# Altium project Daughter_Board_IF_RX.PrjPcb (part 1 of 2)
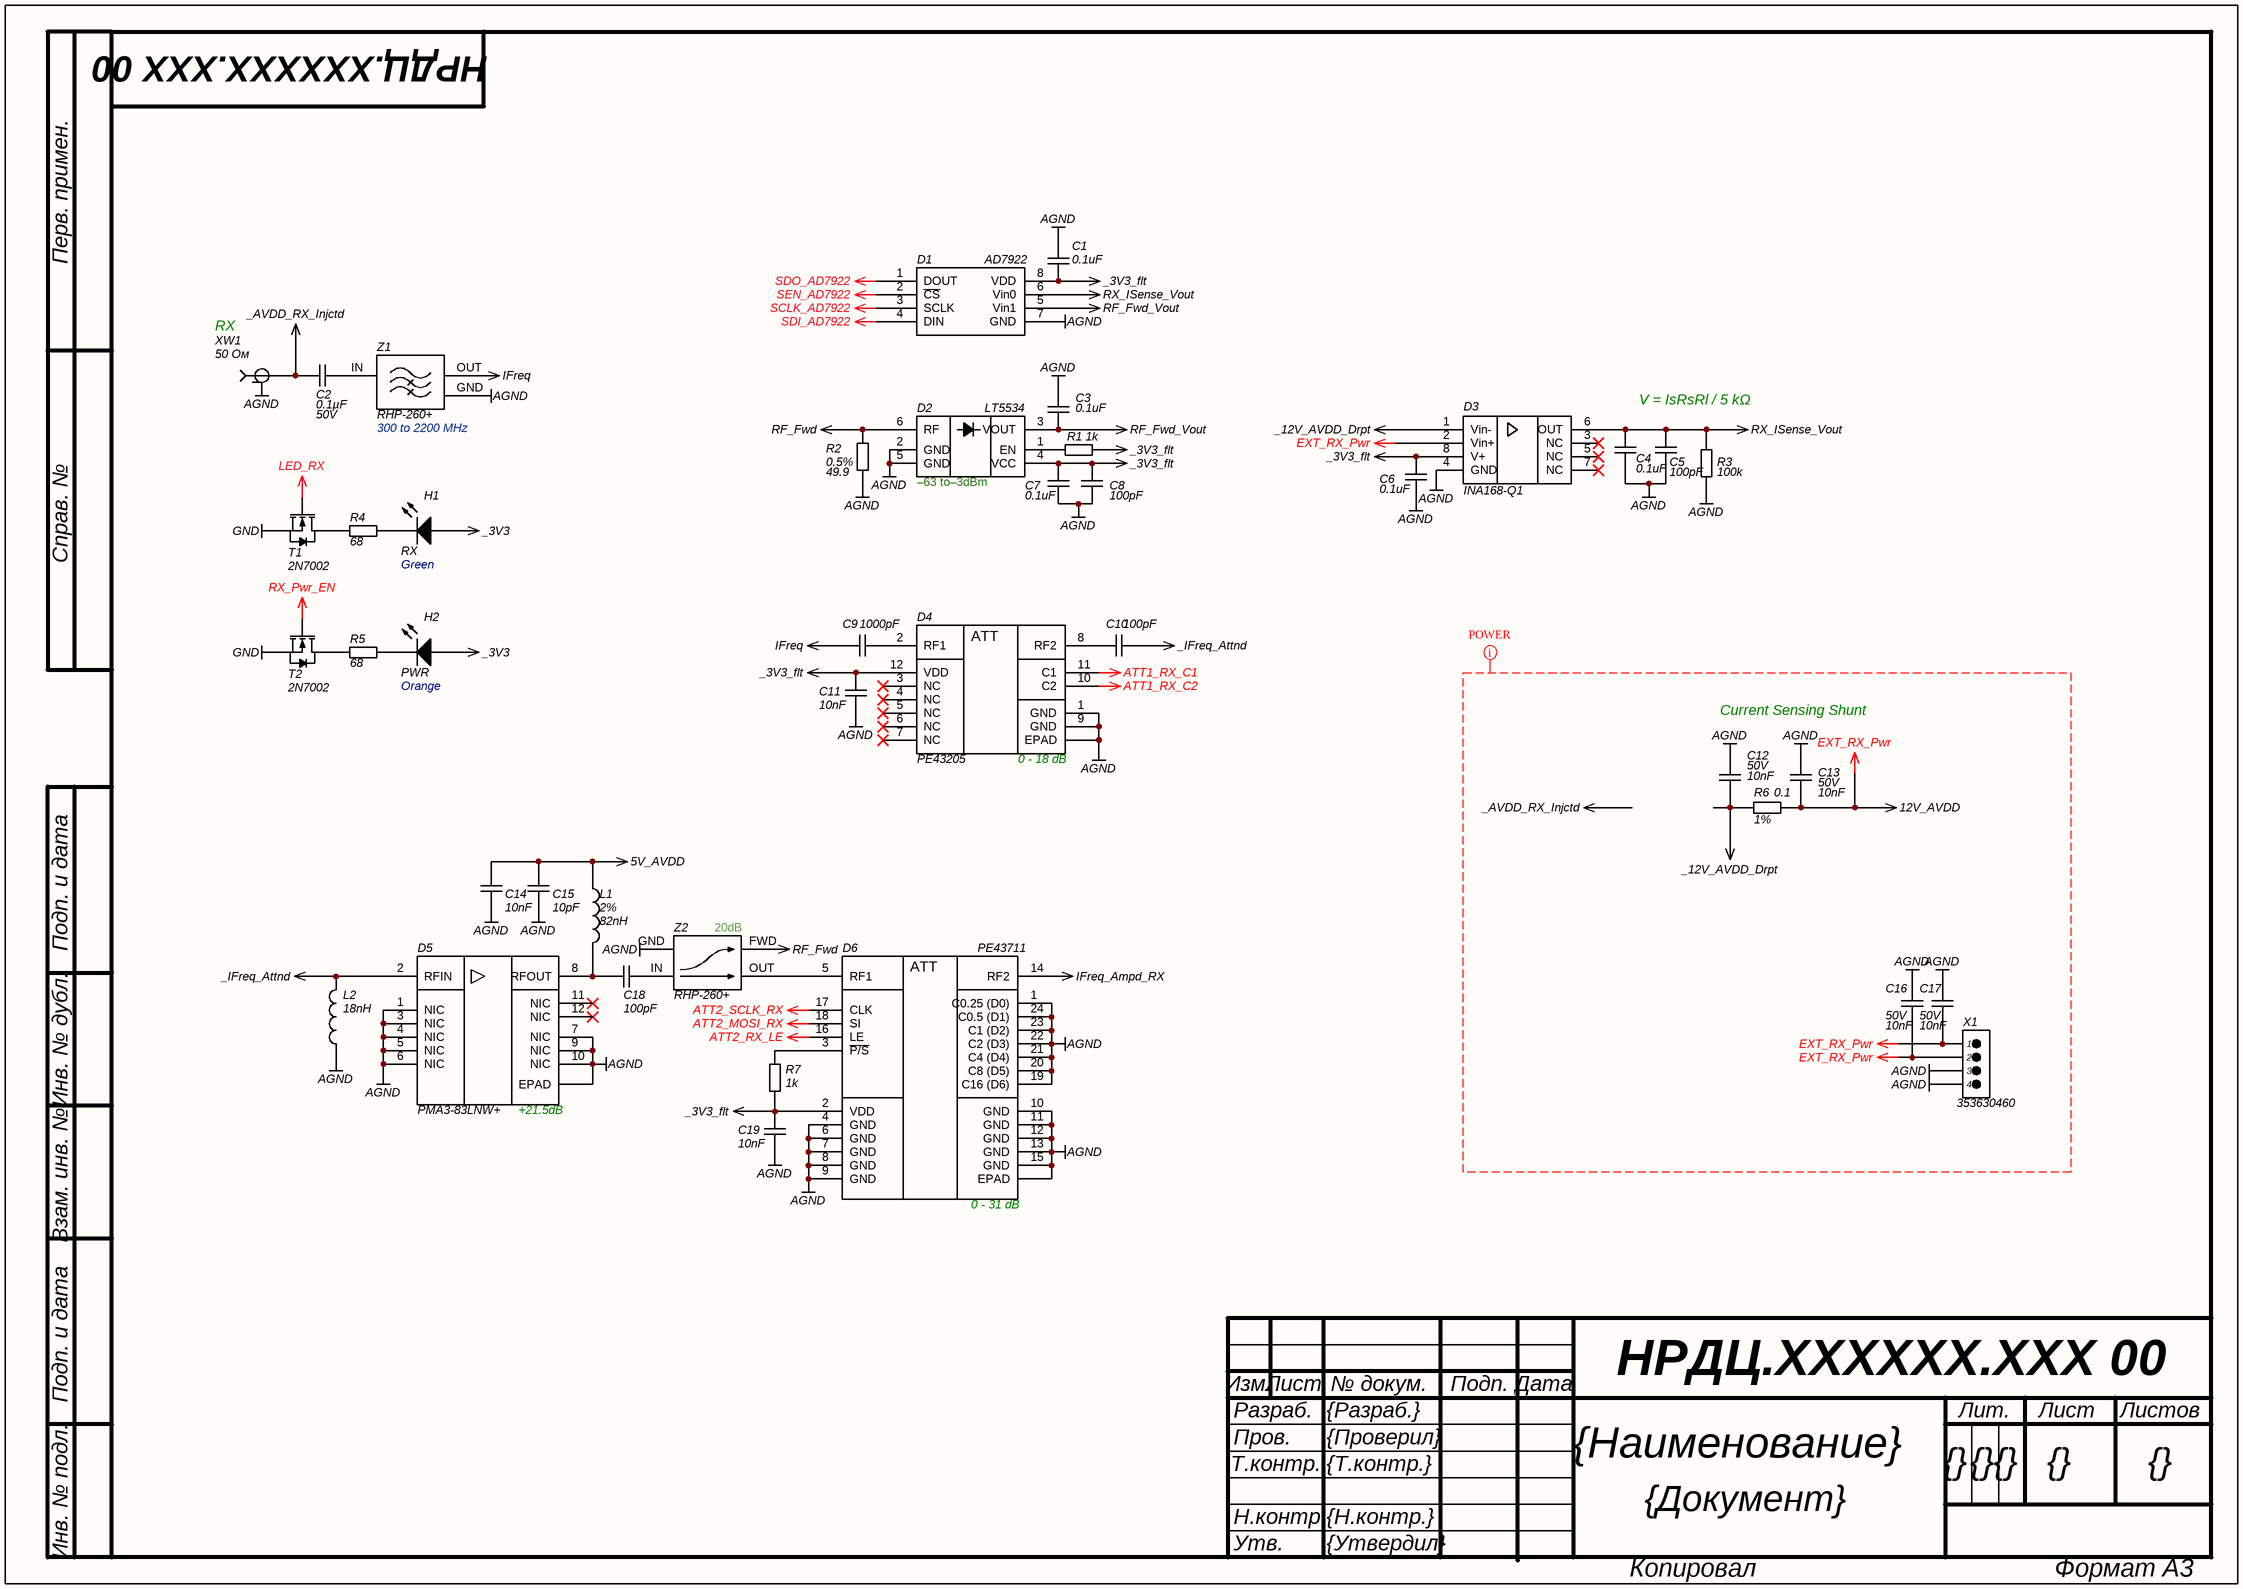
[diagram p0: RX.SchDoc]
6 sheets, 285 parts. Net scope: global (net labels, ports and power ports of the same name join across sheets).
Sheets:
  RX.SchDoc
  ADC.SchDoc
  ADC_CLK.SchDoc
  CPLD.SchDoc
  Power.SchDoc
  DBoard_Conn.SchDoc

## Sheet RX.SchDoc: {Наименование}
size 420 x 297 mm; ApprovedBy: {Утвердил}; CheckedBy: {Проверил}; DrawnBy: {Разраб.}; DocumentNumber: НРДЦ.ХХХХХХ.ХХХ 00; SheetNumber: {}; SheetTotal: {}; Scale: {Мш.}; PageSetup: Record=PageOptions|CenterHorizontal=False|CenterVertical=False|PrintScale=0.95|XCorrection=0.00|YCorrection=0.00|PrintKind=1|BorderSize=5000000|LeftOffset=0|BottomOffset=0|Orientation=1|PaperLength=1000|PaperWidth=1000|Scale=100|PaperSource=15|PrintQuality=600|MediaType=1|DitherType=10|PaperKind=A4|PrintScaleMode=1; ProcessInspection: {Т.контр.}; Mass: {М.}; NormInspection: {Н.контр.}; Letter1Column: {}; Letter2Column: {}; Letter3Column: {}; DocumentType: {Документ}; Rule: PcbType=ProtelPcb

### Parts
C1  value 0.1uF  [C0402]  (hidden comment: CAP)
C2  value 0.1µF  Voltage: 50V  [C1206]  (hidden comment: CAP)
C3  value 0.1uF  [C0402]  (hidden comment: CAP)
C4  value 0.1uF  [C0402]  (hidden comment: CAP)
C5  value 100pF  [C0402]  (hidden comment: CAP)
C6  value 0.1uF  [C0402]  (hidden comment: CAP)
C7  value 0.1uF  [C0402]  (hidden comment: CAP)
C8  value 100pF  [C0402]  (hidden comment: CAP)
C9  value 1000pF  [C0402]  (hidden comment: CAP)
C10  value 100pF  [C0402]  (hidden comment: CAP)
C11  value 10nF  [C0402]  (hidden comment: CAP)
C12  value 10nF  Voltage: 50V  [C0402]  (hidden comment: CAP)
C13  value 10nF  Voltage: 50V  [C0402]  (hidden comment: CAP)
C14  value 10nF  [C0402]  (hidden comment: CAP)
C15  value 10pF  [C0402]  (hidden comment: CAP)
C16  value 10nF  Voltage: 50V  [C0402]  (hidden comment: CAP)
C17  value 10nF  Voltage: 50V  [C0402]  (hidden comment: CAP)
C18  value 100pF  [C0402]  (hidden comment: CAP)
C19  value 10nF  [C0402]  (hidden comment: CAP)
D1  AD7922  [MSOP-8]
D2  LT5534  RF Input Power Range: –63 to–3dBm  [SC70]
D3  INA168-Q1  [TSSOP (8)]
D4  PE43205  [QFN-12]
D5  PMA3-83LNW+  [DQ1225]
D6  PE43711  [QFN-24]
H1  RX  Color: Green  [LED]
H2  PWR  Color: Orange  [LED]
L1  value 82nH  Tolerance: 2%  [L0603_HP]  (hidden comment: Inductor RF)
L2  value 18nH  [L0603_HP]  (hidden comment: Inductor RF)
R1  value 1k  [R0402]  (hidden comment: RES)
R2  value 49.9  Tolerance: 0.5%  [R0402]  (hidden comment: RES)
R3  value 100k  [R0402]  (hidden comment: RES)
R4  value 68  [R0402]  (hidden comment: RES)
R5  value 68  [R0402]  (hidden comment: RES)
R6  value 0.1  Tolerance: 1%  [R0805]  (hidden comment: RES)
R7  value 1k  [R0402]  (hidden comment: RES)
T1  2N7002  [SOT-23]
T2  2N7002  [SOT-23]
X1  353630460  [CON_353630460]
XW1  50 Ом  [MOLEX SD-73251-135 (Gold)]
Z1  RHP-260+  Frequency: 300 to 2200 MHz  [GP731]
Z2  RHP-260+  Coupling: 20dB  [AH202]

### Nets
5V_AVDD: C14.2 C15.2 L1.2
12V_AVDD: C13.1 C16.2 C17.2 D3.2(Vin+) R6.1 X1.1 X1.2  [also labelled EXT_RX_Pwr]
_3V3: H1.2(A) H2.2(A)
_3V3_flt: C1.1 C6.2 C7.2 C8.2 C11.2 C19.2 D1.8(VDD) D2.4(VCC) D3.8(V+) D4.12(VDD) D6.2(VDD) R1.1 R7.1
_12V_AVDD_Drpt: C12.1 D3.1(Vin-) R6.2
_AVDD_RX_Injctd: C2.1 XW1.S(RF)
_IFreq_Attnd: C10.2 D5.2(RFIN) L2.2
AGND: C1.2 C3.1 C4.1 C5.1 C6.1 C7.1 C8.1 C11.1 C12.2 C13.2 C14.1 C15.1 C16.1 C17.1 C19.1 D1.7(GND) D2.2(GND) D2.5(GND) D3.4(GND) D4.1(GND) D4.9(GND) D4.13(EPAD) D5.1(NIC) D5.3(NIC) D5.4(NIC) D5.5(NIC) D5.6(NIC) D5.7(NIC) D5.9(NIC) D5.10(NIC) D5.13(EPAD) D6.1(C0.25_(D0)) D6.4(GND) D6.6(GND) D6.7(GND) D6.8(GND) D6.9(GND) D6.10(GND) D6.11(GND) D6.12(GND) D6.13(GND) D6.15(GND) D6.19(C16_(D6)) D6.20(C8_(D5)) D6.21(C4_(D4)) D6.22(C2_(D3)) D6.23(C1_(D2)) D6.24(C0.5_(D1)) D6.25(EPAD) L2.1 R2.2 R3.1 X1.3 X1.4 XW1.G(GND) Z1.GND
ATT1_RX_C1: D4.11(C1)
ATT1_RX_C2: D4.10(C2)
ATT2_MOSI_RX: D6.18(SI)
ATT2_RX_LE: D6.16(LE)
ATT2_SCLK_RX: D6.17(CLK)
GND: T1.2(S) T2.2(S)
IFreq: C9.1 Z1.OUT
IFreq_Ampd_RX: D6.14(RF2)
LED_RX: T1.1(G)
RF_Fwd: D2.6(RF) R2.1 Z2.FWD
RF_Fwd_Vout: C3.2 D1.5(Vin1) D2.3(VOUT)
RX_ISense_Vout: C4.2 C5.2 D1.6(Vin0) D3.6(OUT) R3.2
RX_Pwr_EN: T2.1(G)
SCLK_AD7922: D1.3(SCLK)
SDI_AD7922: D1.4(DIN)
SDO_AD7922: D1.1(DOUT)
SEN_AD7922: D1.2(~{CS})
NetC2_2: C2.2 Z1.IN
NetC9_2: C9.2 D4.2(RF1)
NetC10_1: C10.1 D4.8(RF2)
NetC18_1: C18.1 D5.8(RFOUT) L1.1
NetC18_2: C18.2 Z2.IN
NetD2_1: D2.1(EN) R1.2
NetD6_3: D6.3(~{P/S}) R7.2
NetD6_5: D6.5(RF1) Z2.OUT
NetH1_1: H1.1(K) R4.2
NetH2_1: H2.1(K) R5.1
NetR4_1: R4.1 T1.3(D)
NetR5_2: R5.2 T2.3(D)

Not connected (* = marked no-connect by the designer): D3 3(NC)* 5(NC)* 7(NC)*; D4 3(NC)* 4(NC)* 5(NC)* 6(NC)* 7(NC)*; D5 11(NIC)* 12(NIC)*; Z2 GND

### Layout directives
net class POWER: 12V_AVDD, _12V_AVDD_Drpt, _AVDD_RX_Injctd, AGND, EXT_RX_Pwr

### Notes on the sheet
- (near XW1) RX
- V = IsRsRl / 5 kΩ
- Current Sensing Shunt
- Labels drawn without touching a wire or pin: AGND
- Перв. примен.
- Справ. №
- Подп. и дата
- Инв. № дубл.
- Взам. инв. №
- Изм.
- Лист
- № докум.
- Подп.
- Дата
- Т.контр.
- Пров.
- Разраб.
- Лит.
- Листов
- Инв. № подл.
- Н.контр.
- Утв.
- Копировал
- Формат А3
- (in symbol PE43205) ATT; 0 - 18 dB
- (in symbol PE43711) ATT; 0 - 31 dB
- (in symbol PMA3-83LNW+) +21.5dB

### Library data of the parts
C1 C3 C4 C6 C7 = CAP: SMD Capacitor; Manufacturer: Murata; Material: X7R; Tolerance: 10%; Voltage: 10V; Type: Ceramic Capacitor; P/N: GRM155R71A104KA01J
C2 = CAP: SMD Capacitor; Manufacturer: Murata; Material: NP0; Tolerance: 5%; Type: Ceramic Capacitor; P/N: GRM31C5C1H104JA01K
C5 C8 C10 C18 = CAP: SMD Capacitor; Manufacturer: Murata; Material: NP0; Tolerance: 1%; Voltage: 50V; Type: Ceramic Capacitor; P/N: GRM1555C1H101FA01D
C9 = CAP: SMD Capacitor; Manufacturer: Murata; Material: NP0; Tolerance: 5%; Voltage: 50V; Type: Ceramic Capacitor; P/N: GRM1555C1H102JA01D
C11 C14 C19 = CAP: SMD Capacitor; Manufacturer: Murata; Material: X7R; Tolerance: 10%; Voltage: 25V; Type: Ceramic Capacitor; P/N: GRM155R71E103KA01D
C12 C13 C16 C17 = CAP: SMD Capacitor; Manufacturer: Murata; Material: X7R; Tolerance: 5%; Type: Ceramic Capacitor; P/N: GRM155R71H103JA88D
C15 = CAP: SMD Capacitor; Manufacturer: Murata; Material: NP0; Tolerance: 1%; Voltage: 50V; Type: Ceramic Capacitor; P/N: GRM1555C1H100FA01D
D1 = AD79x2: 1 MSPS, 10-/12-Bit ADC; Manufacturer: Analog Device; Fast throughput rate: 1MHz; High speed serial interface: SPI®/QSPI™/MICROWIRE™/DSP compatible; Name: AD7922ARM; Type: 2-Channel, 2.35 V to 5.25 V,1 MSPS, 10-/12-Bit ADC; Voltage: 2.35 V to 5.25 V; Package: MSOP-8
D2 = LT5534: 50MHz to 3GHz monolithic RF power / detector; Manufacturer: Linear Technology; Voltage: Single 2.7V to 5.25V; Impedance: 2kΩ; Frequency Range: 50 to 3000 MHz; Name: LT5534; Package: 6-Lead SC70; Type: RF Power Detector; P/N: LT5534; Supplier 1: Digi-Key; Supplier Part Number 1: LT5534ESC6#TRMPBFCT-ND
D3 = INA168-Q1: Automotive-Grade, High-Side, Current-Output, Current-Shunt Monitor; Manufacturer: Texas Instruments; Name: INA168Q; Voltage: 2.7 V to 60 V; P/N: INA168QPWRQ1; Voltage Gain: Adjustable; Frequency Range: 800kHz; Package: TSSOP (8); Type: Current-Shunt Monitor; Supplier 1: Digi-Key; Supplier Part Number 1: 296-17201-1-ND
D4 = PE43205: 50Ω, HaRP™ technology-enhanced / fast switching 2-bit RF Digital Step Attenuator; Manufacturer: Peregrine Technical Solutions; Type: 2-bit, 18 dB; Name: PE43205; P/N: PE43205; Package: Green 12-lead 3x3 mm QFN; Supplier 1: Digi-Key; Supplier Part Number 1: 1046-1114-6-ND
D5 = PMA3-83LNW+: PHEMT based wideband, low noise MMIC amplifier; Manufacturer: Mini-Circuits; Type: LNA; Frequency Range: 0.4 to 8.0 GHz; Impedance: 50Ω; Name: PMA3-83LNW+; Package: DQ1225; P/N: PMA3-83LNW+; Supplier 1: Digi-Key; Supplier Part Number 1: 3157-PMA3-83LNW+CT-ND
D6 = PE43711: The PE43711 is a 50Ω, HaRP™ technology-enhanced, 7-bit RF digital step attenuator; Manufacturer: Peregrine Technical Solutions; P/N: PE43711A-Z; Type: 7-bit RF digital step attenuator (DSA); Name: PE43711; Package: 24-lead 4 × 4 × 0.85 mm QFN; Supplier 1: Digi-Key; Supplier Part Number 1: 1046-1138-1-ND
H1 = LED: CHIP LED LAMP; Manufacturer: Kingbright; Name: APHCM2012; P/N: APHCM2012CGCK-F01; Package: 2.0 x 1.25 mm SMD; Type: CHIP LED LAMP; Supplier 1: Digi-Key; Supplier Part Number 1: 754-1094-1-ND
H2 = LED: CHIP LED LAMP; Manufacturer: Kingbright; Name: APHCM2012; P/N: APHCM2012SECK-F01; Package: 2.0 x 1.25 mm SMD; Type: CHIP LED LAMP
L1 = Inductor RF: Chip SMD Inductor; Manufacturer: Coilcraft; Current: 510mA; Frequency: 1.8GHz; Name: 0603HP-82NXJL; P/N: 0603HP-82NXJLW; Series: 0603HP; Temperature Range: -25…85°C
L2 = Inductor RF: Chip SMD Inductor; Manufacturer: Coilcraft; Current: 1200mA; Frequency: 3.30GHz; Name: 0603HP-18NXJE; Tolerance: 5%; Series: 0603HP; Temperature Range: -25…85°C; P/N: 0603HP-18NXJE
R1 R7 = RES: SMD Resistor; Name: Chip SMD Resistor; Power: 0.062 Wt; Tolerance: 5%; P/N: ERJ-2GEJ102X; Temperature Range: -55…155°C
R2 = RES: SMD Resistor; Manufacturer: Panasonic Electronic Components; Name: Chip SMD Resistor; Power: 0.063 Wt; P/N: ERJ-2RKD49R9X; Temperature Range: -55…155°C
R3 = RES: SMD Resistor; Manufacturer: Panasonic Electronic Components; Name: Chip SMD Resistor; Power: 1/5 Wt; Tolerance: 1%; P/N: ERJ-PA2F1003X; Temperature Range: -55…155°C
R4 R5 = RES: SMD Resistor; Name: Chip SMD Resistor; Power: 0.062 Wt; Tolerance: 5%; P/N: ERJ-2GEJ680X; Temperature Range: -55…155°C
R6 = RES: SMD Resistor; Manufacturer: Panasonic Electronic Components; Name: Chip SMD Resistor; Power: 1/2 Wt; P/N: ERJ-6DSFR10V; Temperature Range: -55…155°C
T1 T2 = 2N7002: N-Channel MOSFET 2N7002; Channel Resistance: 5Ohm; Current: 300mA; Power Dissipation: 0.83W; Voltage: 60V; Name: 2N7002; Type: SOT-23; Package: SOT-23
X1 = 353630460: 2.00mm Pitch Sherlock Wire-to-Board Header, Right-Angle, with Positive Lock, 4 Circuits; Manufacturer: Molex; Mate-with P/N: 355070400; Mate-with Series: 35507; P/N: 353630460; Type: 2.00mm Pitch Sherlock Wire-to-Board Header, Right-Angle; Series: 35363; Pitch: 2.00mm; Name: 353630460; Supplier 1: Digi-Key; Supplier Part Number 1: WM18933-ND
XW1 = RF Connector: 50 Ohms, SMA Jack, Vertica; Manufacturer: Molex; Impedance: 50Ω; P/N: 0732511352; Name: SMA Jack; Type: 50 Ohms, SMA Jack, Vertical, PCB SMT, Gold (Au) Body; Supplier 1: Digi-Key; Supplier Part Number 1: WM9458-ND
Z1 = RHP-260+: High Pass Filter; Manufacturer: Mini-Circuits; Impedance: 50Ω; Name: RHP-260+; P/N: RHP-260+; Type: High Pass Filter; Package: GP731
Z2 = SYD-20-33+: Directional Coupler; Manufacturer: Mini-Circuits; Impedance: 50Ω; Frequency: 30 to 3000 MHz; Name: SYD-20-33+; P/N: SYD-20-33+; Type: Directional Coupler; Package: AH202

## Sheet ADC.SchDoc: {Наименование}
size 420 x 297 mm; DocumentNumber: НРДЦ.ХХХХХХ.ХХХ ХХ; SheetNumber: {}; SheetTotal: {}; PageSetup: Record=PageOptions|CenterHorizontal=False|CenterVertical=False|PrintScale=0.95|XCorrection=0.00|YCorrection=0.00|PrintKind=1|BorderSize=5000000|LeftOffset=0|BottomOffset=0|Orientation=1|PaperLength=1000|PaperWidth=1000|Scale=100|PaperSource=15|PrintQuality=600|MediaType=1|DitherType=10|PaperKind=A4|PrintScaleMode=1; Rule: PcbType=ProtelPcb
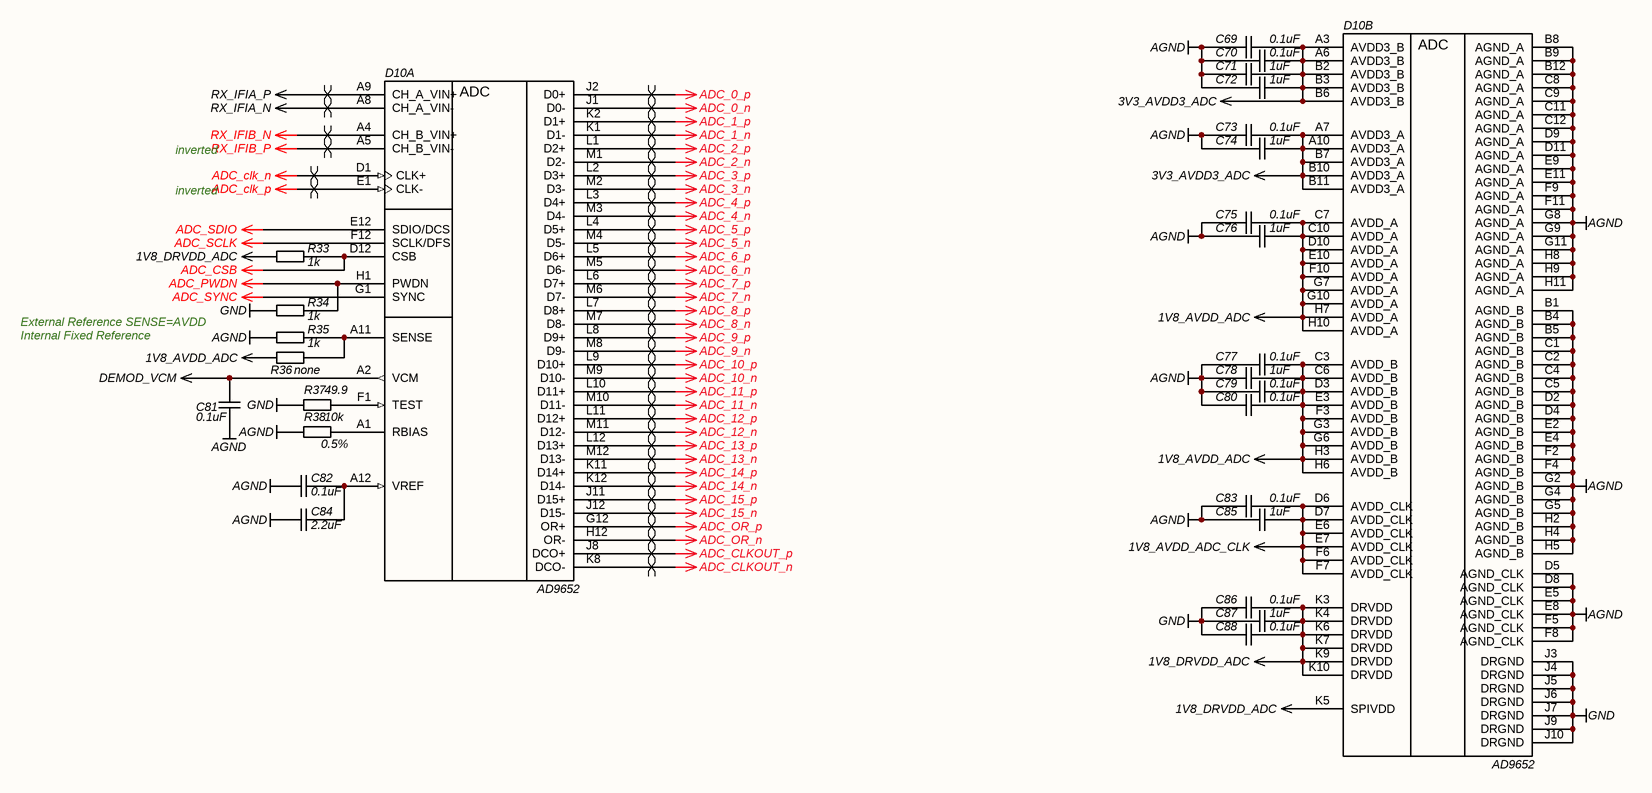
[diagram p1: ADC.SchDoc]

### Parts
C69  value 0.1uF  [C0402]  (hidden comment: CAP)
C70  value 0.1uF  [C0402]  (hidden comment: CAP)
C71  value 1uF  [C0402]  (hidden comment: CAP)
C72  value 1uF  [C0402]  (hidden comment: CAP)
C73  value 0.1uF  [C0402]  (hidden comment: CAP)
C74  value 1uF  [C0402]  (hidden comment: CAP)
C75  value 0.1uF  [C0402]  (hidden comment: CAP)
C76  value 1uF  [C0402]  (hidden comment: CAP)
C77  value 0.1uF  [C0402]  (hidden comment: CAP)
C78  value 1uF  [C0402]  (hidden comment: CAP)
C79  value 0.1uF  [C0402]  (hidden comment: CAP)
C80  value 0.1uF  [C0402]  (hidden comment: CAP)
C81  value 0.1uF  [C0402]  (hidden comment: CAP)
C82  value 0.1uF  [C0402]  (hidden comment: CAP)
C83  value 0.1uF  [C0402]  (hidden comment: CAP)
C84  value 2.2uF  [C0603]  (hidden comment: CAP)
C85  value 1uF  [C0402]  (hidden comment: CAP)
C86  value 0.1uF  [C0402]  (hidden comment: CAP)
C87  value 1uF  [C0402]  (hidden comment: CAP)
C88  value 0.1uF  [C0402]  (hidden comment: CAP)
D10  AD9652  [BGA144x12]  (parts A,B of 2)
R33  value 1k  [R0402]  (hidden comment: RES)
R34  value 1k  [R0402]  (hidden comment: RES)
R35  value 1k  [R0402]  (hidden comment: RES)
R36  value none  [R0402]  (hidden comment: RES)
R37  value 49.9  [R0402]  (hidden comment: RES)
R38  value 10k  Tolerance: 0.5%  [R0402]  (hidden comment: RES)

### Nets
1V8_AVDD_ADC: C75.2 C76.2 C77.2 C78.2 C79.2 C80.2 D10.C3(AVDD_B) D10.C6(AVDD_B) D10.C7(AVDD_A) D10.C10(AVDD_A) D10.D3(AVDD_B) D10.D10(AVDD_A) D10.E3(AVDD_B) D10.E10(AVDD_A) D10.F3(AVDD_B) D10.F10(AVDD_A) D10.G3(AVDD_B) D10.G6(AVDD_B) D10.G7(AVDD_A) D10.G10(AVDD_A) D10.H3(AVDD_B) D10.H6(AVDD_B) D10.H7(AVDD_A) D10.H10(AVDD_A) R36.2
1V8_AVDD_ADC_CLK: C83.2 C85.2 D10.D6(AVDD_CLK) D10.D7(AVDD_CLK) D10.E6(AVDD_CLK) D10.E7(AVDD_CLK) D10.F6(AVDD_CLK) D10.F7(AVDD_CLK)
1V8_DRVDD_ADC: C86.2 C87.2 C88.2 D10.K3(DRVDD) D10.K4(DRVDD) D10.K5(SPIVDD) D10.K6(DRVDD) D10.K7(DRVDD) D10.K9(DRVDD) D10.K10(DRVDD) R33.2
3V3_AVDD3_ADC: C69.2 C70.2 C71.2 C72.2 C73.2 C74.2 D10.A3(AVDD3_B) D10.A6(AVDD3_B) D10.A7(AVDD3_A) D10.A10(AVDD3_A) D10.B2(AVDD3_B) D10.B3(AVDD3_B) D10.B6(AVDD3_B) D10.B7(AVDD3_A) D10.B10(AVDD3_A) D10.B11(AVDD3_A)
ADC_0_n: D10.J1(D0-)
ADC_0_p: D10.J2(D0+)
ADC_1_n: D10.K1(D1-)
ADC_1_p: D10.K2(D1+)
ADC_2_n: D10.M1(D2-)
ADC_2_p: D10.L1(D2+)
ADC_3_n: D10.M2(D3-)
ADC_3_p: D10.L2(D3+)
ADC_4_n: D10.M3(D4-)
ADC_4_p: D10.L3(D4+)
ADC_5_n: D10.M4(D5-)
ADC_5_p: D10.L4(D5+)
ADC_6_n: D10.M5(D6-)
ADC_6_p: D10.L5(D6+)
ADC_7_n: D10.M6(D7-)
ADC_7_p: D10.L6(D7+)
ADC_8_n: D10.M7(D8-)
ADC_8_p: D10.L7(D8+)
ADC_9_n: D10.M8(D9-)
ADC_9_p: D10.L8(D9+)
ADC_10_n: D10.M9(D10-)
ADC_10_p: D10.L9(D10+)
ADC_11_n: D10.M10(D11-)
ADC_11_p: D10.L10(D11+)
ADC_12_n: D10.M11(D12-)
ADC_12_p: D10.L11(D12+)
ADC_13_n: D10.M12(D13-)
ADC_13_p: D10.L12(D13+)
ADC_14_n: D10.K12(D14-)
ADC_14_p: D10.K11(D14+)
ADC_15_n: D10.J12(D15-)
ADC_15_p: D10.J11(D15+)
ADC_clk_n: D10.D1(CLK+)
ADC_clk_p: D10.E1(CLK-)
ADC_CLKOUT_n: D10.K8(DCO-)
ADC_CLKOUT_p: D10.J8(DCO+)
ADC_CSB: D10.D12(CSB) R33.1
ADC_OR_n: D10.H12(OR-)
ADC_OR_p: D10.G12(OR+)
ADC_PWDN: D10.H1(PWDN) R34.1
ADC_SCLK: D10.F12(SCLK/DFS)
ADC_SDIO: D10.E12(SDIO/DCS)
ADC_SYNC: D10.G1(SYNC)
AGND: C69.1 C70.1 C71.1 C72.1 C73.1 C74.1 C75.1 C76.1 C77.1 C78.1 C79.1 C80.1 C81.1 C82.1 C83.1 C84.2 C85.1 D10.B1(AGND_B) D10.B4(AGND_B) D10.B5(AGND_B) D10.B8(AGND_A) D10.B9(AGND_A) D10.B12(AGND_A) D10.C1(AGND_B) D10.C2(AGND_B) D10.C4(AGND_B) D10.C5(AGND_B) D10.C8(AGND_A) D10.C9(AGND_A) D10.C11(AGND_A) D10.C12(AGND_A) D10.D2(AGND_B) D10.D4(AGND_B) D10.D5(AGND_CLK) D10.D8(AGND_CLK) D10.D9(AGND_A) D10.D11(AGND_A) D10.E2(AGND_B) D10.E4(AGND_B) D10.E5(AGND_CLK) D10.E8(AGND_CLK) D10.E9(AGND_A) D10.E11(AGND_A) D10.F2(AGND_B) D10.F4(AGND_B) D10.F5(AGND_CLK) D10.F8(AGND_CLK) D10.F9(AGND_A) D10.F11(AGND_A) D10.G2(AGND_B) D10.G4(AGND_B) D10.G5(AGND_B) D10.G8(AGND_A) D10.G9(AGND_A) D10.G11(AGND_A) D10.H2(AGND_B) D10.H4(AGND_B) D10.H5(AGND_B) D10.H8(AGND_A) D10.H9(AGND_A) D10.H11(AGND_A) R35.2 R38.2
DEMOD_VCM: C81.2 D10.A2(VCM)
GND: C86.1 C87.1 C88.1 D10.J3(DRGND) D10.J4(DRGND) D10.J5(DRGND) D10.J6(DRGND) D10.J7(DRGND) D10.J9(DRGND) D10.J10(DRGND) R34.2 R37.1
RX_IFIA_N: D10.A8(CH_A_VIN-)
RX_IFIA_P: D10.A9(CH_A_VIN+)
RX_IFIB_N: D10.A4(CH_B_VIN+)
RX_IFIB_P: D10.A5(CH_B_VIN-)
NetC82_2: C82.2 C84.1 D10.A12(VREF)
NetD10_A1: D10.A1(RBIAS) R38.1
NetD10_A11: D10.A11(SENSE) R35.1 R36.1
NetD10_F1: D10.F1(TEST) R37.2

### Layout directives
differential pair: ADC_0_n, ADC_0_p, ADC_1_n, ADC_1_p, ADC_2_n, ADC_2_p, ADC_3_n, ADC_3_p, ADC_4_n, ADC_4_p, ADC_5_n, ADC_5_p, ADC_6_n, ADC_6_p, ADC_7_n, ADC_7_p, ADC_8_n, ADC_8_p, ADC_9_n, ADC_9_p, ADC_10_n, ADC_10_p, ADC_11_n, ADC_11_p, ADC_12_n, ADC_12_p, ADC_13_n, ADC_13_p, ADC_14_n, ADC_14_p, ADC_15_n, ADC_15_p, ADC_clk_n, ADC_clk_p, ADC_CLKOUT_n, ADC_CLKOUT_p, ADC_OR_n, ADC_OR_p, RX_IFIA_N, RX_IFIA_P, RX_IFIB_N, RX_IFIB_P

### Notes on the sheet
- inverted
- External Reference SENSE=AVDD
  Internal Fixed Reference SENSE=GND
- Подп. и дата
- Инв. № дубл.
- Взам. инв. №
- Инв. № подл.
- Лист
- Изм.
- № докум.
- Подп.
- Дата
- Копировал
- Формат А3

### Library data of the parts
C69 C70 C73 C75 C77 C79 C80 C83 C86 C88 = CAP: SMD Capacitor; Manufacturer: Murata; Material: X7R; Tolerance: 10%; Voltage: 16V; Type: Ceramic Capacitor; P/N: GRM155R71C104KA88J
C71 C72 C74 C76 C78 C85 C87 = CAP: SMD Capacitor; Manufacturer: Murata; Material: X7R; Tolerance: 10%; Voltage: 6.3V; Type: Ceramic Capacitor; P/N: GRM155R70J105KA12J
C81 C82 = CAP: as C1 on sheet RX
C84 = CAP: SMD Capacitor; Manufacturer: Murata; Material: X7R; Tolerance: 10%; Voltage: 10V; Type: Ceramic Capacitor; P/N: GRM188R71A225KE15D
D10 = AD9652: Dual, 16-bit analog-to-digital converter (ADC) / with sampling speeds of up to 310 MSPS; Manufacturer: Analog Devices; P/N: AD9652BBCZ-310; Name: AD9652; Sampling Frequency: 310 MSPS; Type: ADC; Supplier 1: Digi-Key; Supplier Part Number 1: AD9652BBCZ-310-ND
R33-R35 = RES: SMD Resistor; Manufacturer: Panasonic Electronic Components; Name: Chip SMD Resistor; Power: 0.062 Wt; Tolerance: 5%; P/N: ERJ-2GEJ102X; Temperature Range: -55…155°C
R36 = RES: SMD Resistor; Manufacturer: Panasonic Electronic Components; Name: Chip SMD Resistor; Power: 0.062 Wt; P/N: ERJ-2GE0R00X; Temperature Range: -55…155°C
R37 = RES: SMD Resistor; Manufacturer: Panasonic Electronic Components; Name: Chip SMD Resistor; Power: 0.063 Wt; Tolerance: 0.5%; P/N: ERJ-2RKD49R9X; Temperature Range: -55…155°C
R38 = RES: SMD Resistor; Manufacturer: Panasonic Electronic Components; Name: Chip SMD Resistor; Power: 0.063 Wt; P/N: ERA-2AED103X; Temperature Range: -55…155°C

## Sheet ADC_CLK.SchDoc: {Наименование}
size 420 x 297 mm; DocumentNumber: НРДЦ.ХХХХХХ.ХХХ ХХ; SheetNumber: {}; SheetTotal: {}; PageSetup: Record=PageOptions|CenterHorizontal=False|CenterVertical=False|PrintScale=0.95|XCorrection=0.00|YCorrection=0.00|PrintKind=1|BorderSize=5000000|LeftOffset=0|BottomOffset=0|Orientation=1|PaperLength=1000|PaperWidth=1000|Scale=100|PaperSource=15|PrintQuality=600|MediaType=1|DitherType=10|PaperKind=A4|PrintScaleMode=1; Rule: PcbType=ProtelPcb
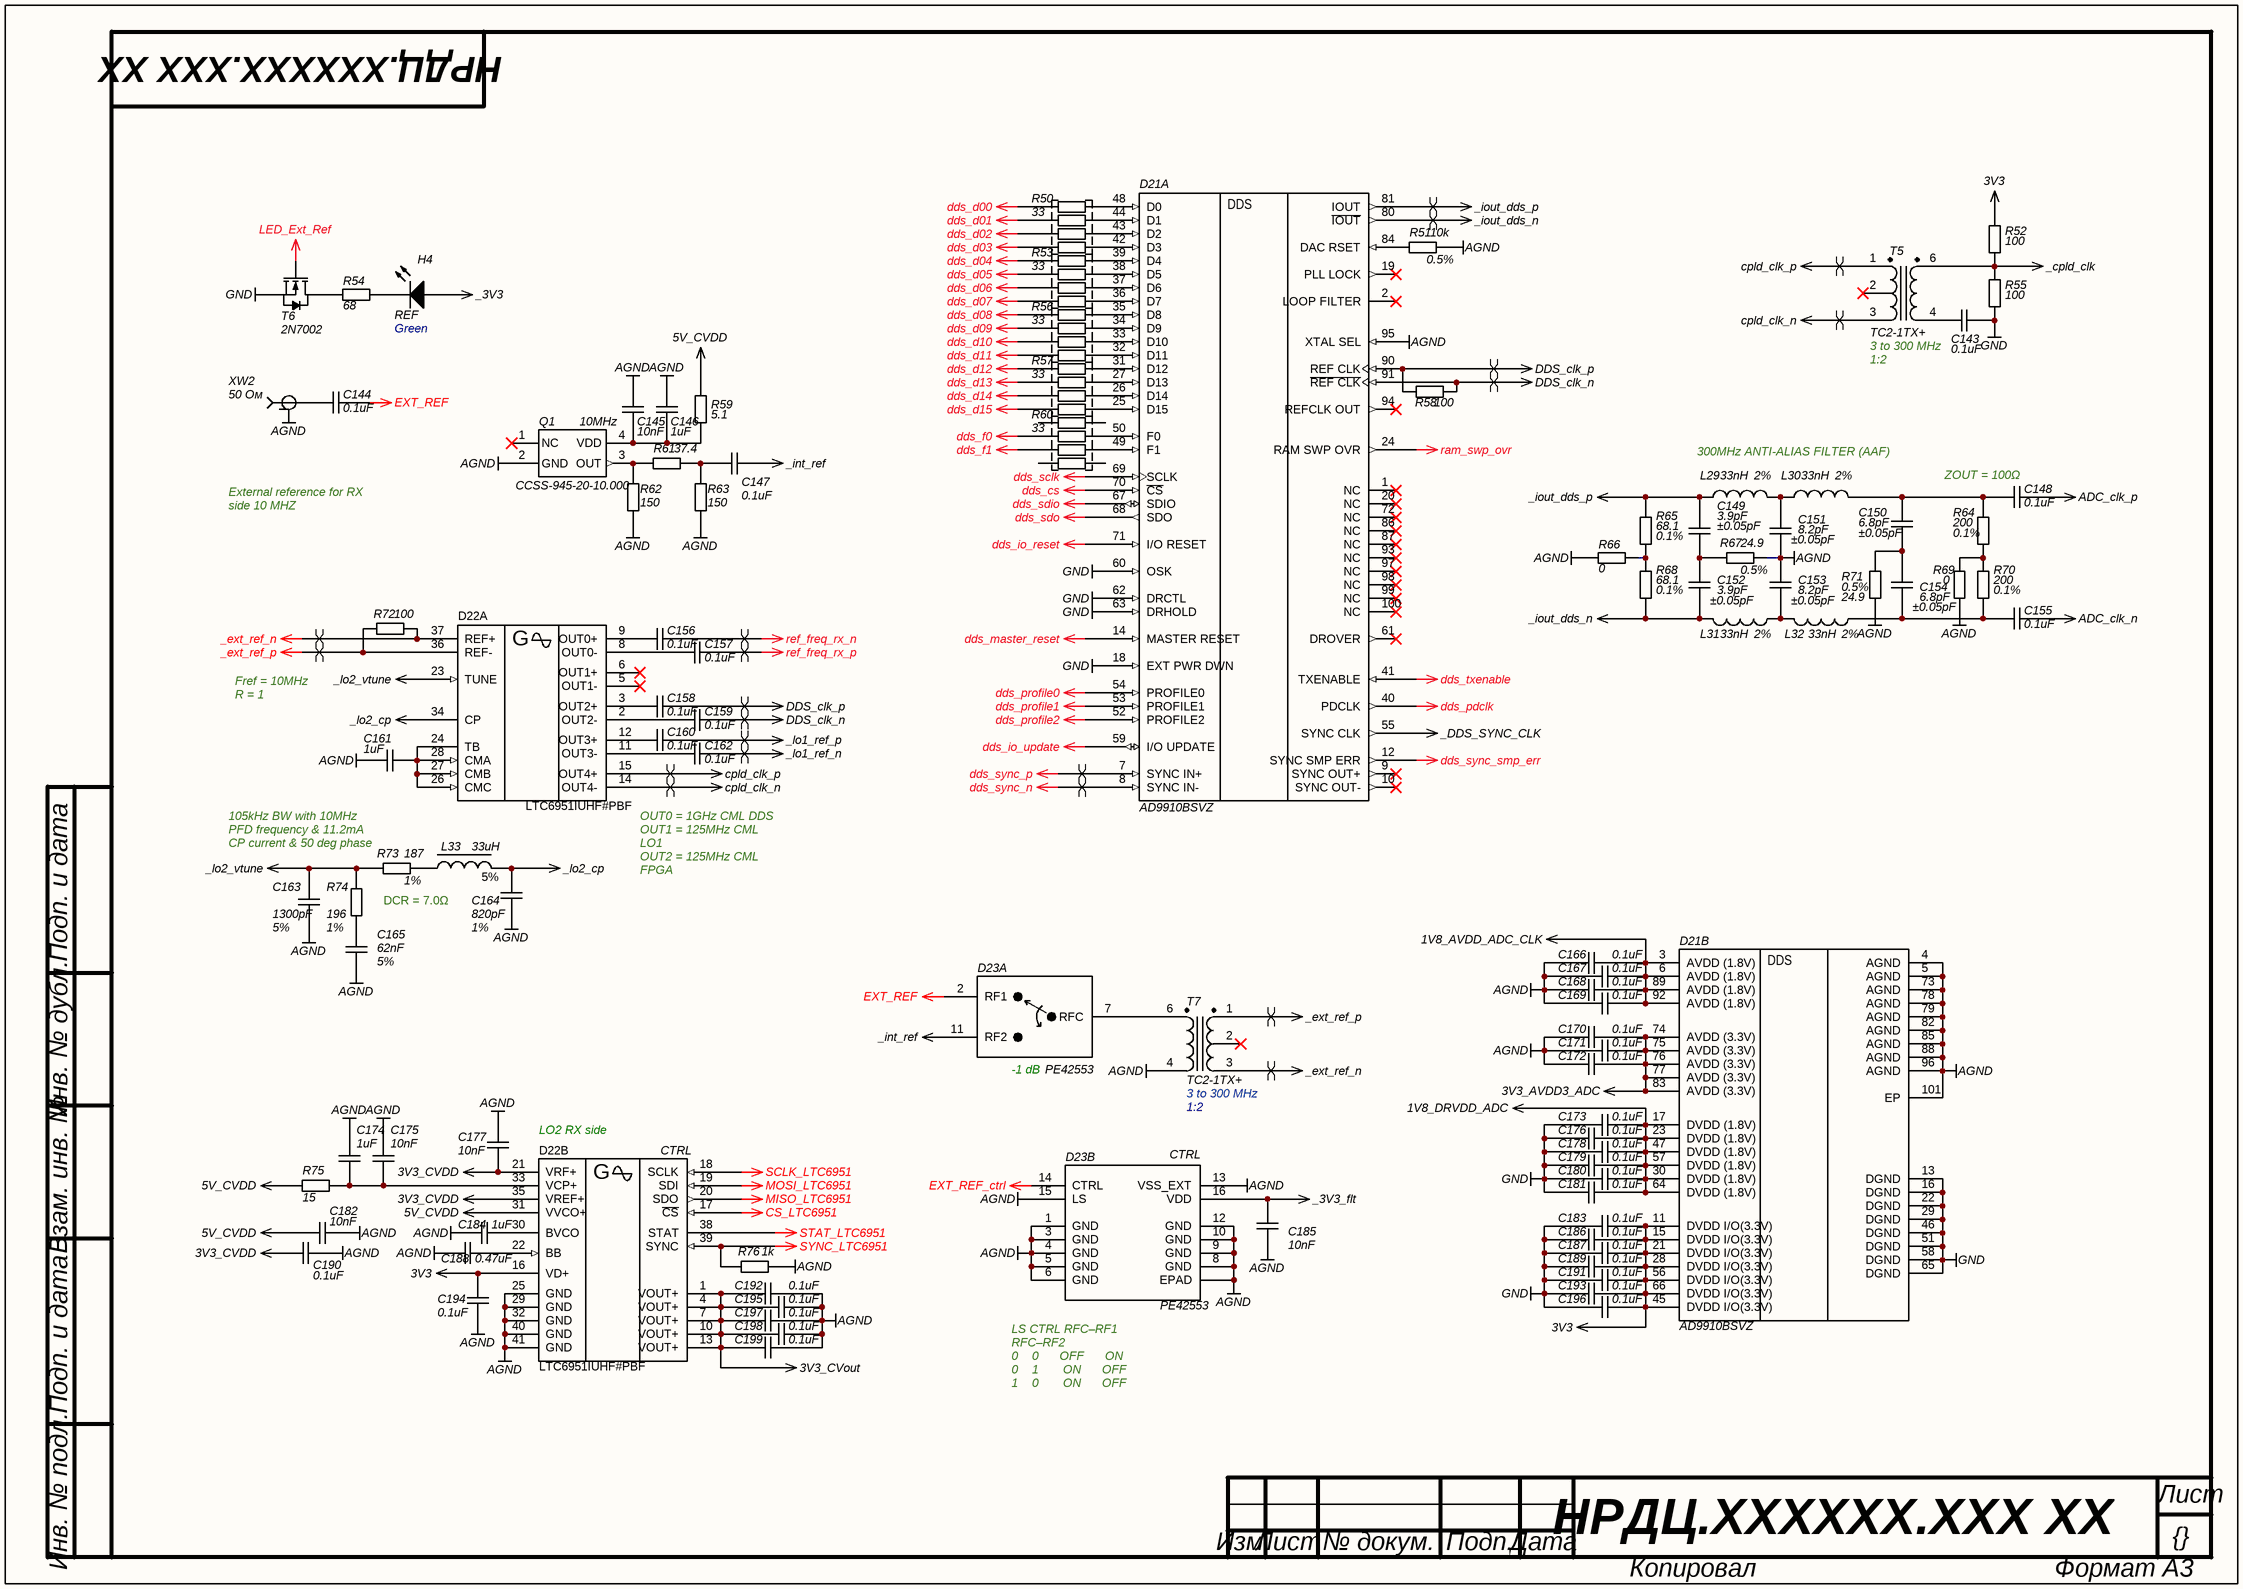
[diagram p2: ADC_CLK.SchDoc]

### Parts
C143  value 0.1uF  [C0402]  (hidden comment: CAP)
C144  value 0.1uF  [C0402]  (hidden comment: CAP)
C145  value 10nF  [C0402]  (hidden comment: CAP)
C146  value 1uF  [C0805]  (hidden comment: CAP)
C147  value 0.1uF  [C0402]  (hidden comment: CAP)
C148  value 0.1uF  [C0402]  (hidden comment: CAP)
C149  value 3.9pF  Tolerance: ±0.05pF  [C0402]  (hidden comment: CAP)
C150  value 6.8pF  Tolerance: ±0.05pF  [C0402]  (hidden comment: CAP)
C151  value 8.2pF  Tolerance: ±0.05pF  [C0402]  (hidden comment: CAP)
C152  value 3.9pF  Tolerance: ±0.05pF  [C0402]  (hidden comment: CAP)
C153  value 8.2pF  Tolerance: ±0.05pF  [C0402]  (hidden comment: CAP)
C154  value 6.8pF  Tolerance: ±0.05pF  [C0402]  (hidden comment: CAP)
C155  value 0.1uF  [C0402]  (hidden comment: CAP)
C156  value 0.1uF  [C0402]  (hidden comment: CAP)
C157  value 0.1uF  [C0402]  (hidden comment: CAP)
C158  value 0.1uF  [C0402]  (hidden comment: CAP)
C159  value 0.1uF  [C0402]  (hidden comment: CAP)
C160  value 0.1uF  [C0402]  (hidden comment: CAP)
C161  value 1uF  [C0402]  (hidden comment: CAP)
C162  value 0.1uF  [C0402]  (hidden comment: CAP)
C163  value 1300pF  Tolerance: 5%  [C0603]  (hidden comment: CAP)
C164  value 820pF  Tolerance: 1%  [C0603]  (hidden comment: CAP)
C165  value 62nF  Tolerance: 5%  [C1206]  (hidden comment: CAP)
C166  value 0.1uF  [C0402]  (hidden comment: CAP)
C167  value 0.1uF  [C0402]  (hidden comment: CAP)
C168  value 0.1uF  [C0402]  (hidden comment: CAP)
C169  value 0.1uF  [C0402]  (hidden comment: CAP)
C170  value 0.1uF  [C0402]  (hidden comment: CAP)
C171  value 0.1uF  [C0402]  (hidden comment: CAP)
C172  value 0.1uF  [C0402]  (hidden comment: CAP)
C173  value 0.1uF  [C0402]  (hidden comment: CAP)
C174  value 1uF  [C0805]  (hidden comment: CAP)
C175  value 10nF  [C0402]  (hidden comment: CAP)
C176  value 0.1uF  [C0402]  (hidden comment: CAP)
C177  value 10nF  [C0402]  (hidden comment: CAP)
C178  value 0.1uF  [C0402]  (hidden comment: CAP)
C179  value 0.1uF  [C0402]  (hidden comment: CAP)
C180  value 0.1uF  [C0402]  (hidden comment: CAP)
C181  value 0.1uF  [C0402]  (hidden comment: CAP)
C182  value 10nF  [C0402]  (hidden comment: CAP)
C183  value 0.1uF  [C0402]  (hidden comment: CAP)
C184  value 1uF  [C0402]  (hidden comment: CAP)
C185  value 10nF  [C0402]  (hidden comment: CAP)
C186  value 0.1uF  [C0402]  (hidden comment: CAP)
C187  value 0.1uF  [C0402]  (hidden comment: CAP)
C188  value 0.47uF  [C0603]  (hidden comment: CAP)
C189  value 0.1uF  [C0402]  (hidden comment: CAP)
C190  value 0.1uF  [C0402]  (hidden comment: CAP)
C191  value 0.1uF  [C0402]  (hidden comment: CAP)
C192  value 0.1uF  [C0402]  (hidden comment: CAP)
C193  value 0.1uF  [C0402]  (hidden comment: CAP)
C194  value 0.1uF  [C0402]  (hidden comment: CAP)
C195  value 0.1uF  [C0402]  (hidden comment: CAP)
C196  value 0.1uF  [C0402]  (hidden comment: CAP)
C197  value 0.1uF  [C0402]  (hidden comment: CAP)
C198  value 0.1uF  [C0402]  (hidden comment: CAP)
C199  value 0.1uF  [C0402]  (hidden comment: CAP)
D21  AD9910BSVZ  [Analog_Devices_SV-100-4_IPC_A]  (parts A,B of 2)
D22  LTC6951IUHF#PBF  [Analog_Devices_UHF-40-05-08-1951_IPC_A]  (parts A,B of 2)
D23  PE42553  [QFN-16]  (parts A,B of 2)
H4  REF  Color: Green  [LED]
L29  value 33nH  Tolerance: 2%  [L0603_HP]  (hidden comment: Inductor RF)
L30  value 33nH  Tolerance: 2%  [L0603_HP]  (hidden comment: Inductor RF)
L31  value 33nH  Tolerance: 2%  [L0603_HP]  (hidden comment: Inductor RF)
L32  value 33nH  Tolerance: 2%  [L0603_HP]  (hidden comment: Inductor RF)
L33  value 33uH  Tolerance: 5%  [L1008_LS]  (hidden comment: Inductor)
Q1  CCSS-945-20-10.000  Frequency: 10MHz  [CVCSO-914]
R50  value 33  [EXN8V]  (hidden comment: RES 4x0402)
R51  value 10k  Tolerance: 0.5%  [R0402]  (hidden comment: RES)
R52  value 100  [R0402]  (hidden comment: RES)
R53  value 33  [EXN8V]  (hidden comment: RES 4x0402)
R54  value 68  [R0402]  (hidden comment: RES)
R55  value 100  [R0402]  (hidden comment: RES)
R56  value 33  [EXN8V]  (hidden comment: RES 4x0402)
R57  value 33  [EXN8V]  (hidden comment: RES 4x0402)
R58  value 100  [R0402]  (hidden comment: RES)
R59  value 5.1  [R0603]  (hidden comment: RES)
R60  value 33  [EXN8V]  (hidden comment: RES 4x0402)
R61  value 37.4  [R0402]  (hidden comment: RES)
R62  value 150  [R0402]  (hidden comment: RES)
R63  value 150  [R0402]  (hidden comment: RES)
R64  value 200  Tolerance: 0.1%  [R0402]  (hidden comment: RES)
R65  value 68.1  Tolerance: 0.1%  [R0402]  (hidden comment: RES)
R66  value 0  [R0402]  (hidden comment: RES)
R67  value 24.9  Tolerance: 0.5%  [R0402]  (hidden comment: RES)
R68  value 68.1  Tolerance: 0.1%  [R0402]  (hidden comment: RES)
R69  value 0  [R0402]  (hidden comment: RES)
R70  value 200  Tolerance: 0.1%  [R0402]  (hidden comment: RES)
R71  value 24.9  Tolerance: 0.5%  [R0402]  (hidden comment: RES)
R72  value 100  [R0402]  (hidden comment: RES)
R73  value 187  Tolerance: 1%  [R0402]  (hidden comment: RES)
R74  value 196  Tolerance: 1%  [R0402]  (hidden comment: RES)
R75  value 15  [R0603]  (hidden comment: RES)
R76  value 1k  [R0402]  (hidden comment: RES)
T5  TC2-1TX+  Frequency: 3 to 300 MHz  Ratio: 1:2  [AT1521]
T6  2N7002  [SOT-23]
T7  TC2-1TX+  Frequency: 3 to 300 MHz  Ratio: 1:2  [AT1521]
XW2  50 Ом  [MOLEX SD-73251-135 (Gold)]

### Nets
1V8_AVDD_ADC_CLK: C166.2 C167.2 C168.2 C169.2 D21.3(AVDD_(1.8V)) D21.6(AVDD_(1.8V)) D21.89(AVDD_(1.8V)) D21.92(AVDD_(1.8V))
1V8_DRVDD_ADC: C173.2 C176.2 C178.2 C179.2 C180.2 C181.2 D21.17(DVDD_(1.8V)) D21.23(DVDD_(1.8V)) D21.30(DVDD_(1.8V)) D21.47(DVDD_(1.8V)) D21.57(DVDD_(1.8V)) D21.64(DVDD_(1.8V))
3V3: C183.2 C186.2 C187.2 C189.2 C191.2 C193.2 C194.2 C196.2 D21.11(DVDD_I/O(3.3V)) D21.15(DVDD_I/O(3.3V)) D21.21(DVDD_I/O(3.3V)) D21.28(DVDD_I/O(3.3V)) D21.45(DVDD_I/O(3.3V)) D21.56(DVDD_I/O(3.3V)) D21.66(DVDD_I/O(3.3V)) D22.16(VD+) R52.2
3V3_AVDD3_ADC: C170.2 C171.2 C172.2 D21.74(AVDD_(3.3V)) D21.75(AVDD_(3.3V)) D21.76(AVDD_(3.3V)) D21.77(AVDD_(3.3V)) D21.83(AVDD_(3.3V))
3V3_CVDD: C177.2 C190.2 D22.21(VRF+) D22.35(VREF+)
3V3_CVout: C192.1 C195.1 C197.1 C198.1 C199.1 D22.1(VOUT+) D22.4(VOUT+) D22.7(VOUT+) D22.10(VOUT+) D22.13(VOUT+)
5V_CVDD: C182.1 D22.31(VVCO+) R59.2 R75.2
_3V3: H4.2(A)
_3V3_flt: C185.1 D23.16(VDD)
_cpld_clk: R52.1 R55.2 T5.6
_DDS_SYNC_CLK: D21.55(SYNC_CLK)
_ext_ref_n: D22.37(REF+) R72.2 T7.3
_ext_ref_p: D22.36(REF-) R72.1 T7.1
_int_ref: C147.1 D23.11(RF2)
_iout_dds_n: C152.2 D21.80(~{IOUT}) L31.1 R68.2
_iout_dds_p: C149.1 D21.81(IOUT) L29.1 R65.1
_lo1_ref_n: C162.1
_lo1_ref_p: C160.1
_lo2_cp: C164.2 D22.34(CP) L33.2
_lo2_vtune: C163.2 D22.23(TUNE) R73.2 R74.1
ADC_clk_n: C155.1
ADC_clk_p: C148.1
AGND: C145.1 C146.1 C151.2 C153.1 C161.1 C163.1 C164.1 C165.1 C166.1 C167.1 C168.1 C169.1 C170.1 C171.1 C172.1 C174.1 C175.1 C177.1 C182.2 C184.1 C185.2 C188.2 C190.1 C192.2 C194.1 C195.2 C197.2 C198.2 C199.2 D21.4(AGND) D21.5(AGND) D21.73(AGND) D21.78(AGND) D21.79(AGND) D21.82(AGND) D21.85(AGND) D21.88(AGND) D21.95(XTAL_SEL) D21.96(AGND) D21.101(EP) D22.25(GND) D22.29(GND) D22.32(GND) D22.40(GND) D22.41(GND) D23.1(GND) D23.3(GND) D23.4(GND) D23.5(GND) D23.6(GND) D23.8(GND) D23.9(GND) D23.10(GND) D23.12(GND) D23.13(VSS_EXT) D23.15(LS) D23.17(EPAD) Q1.2(GND) R51.1 R62.2 R63.2 R66.1 R67.2 R69.2 R71.2 R76.1 T7.4 XW2.G(GND)
cpld_clk_n: D22.14(OUT4-) T5.3
cpld_clk_p: D22.15(OUT4+) T5.1
CS_LTC6951: D22.17(~{CS})
DDS_clk_n: C159.1 D21.91(~{REF_CLK}) R58.1
DDS_clk_p: C158.1 D21.90(REF_CLK) R58.2
dds_cs: D21.70(~{CS})
dds_d00: R50.4
dds_d01: R50.3
dds_d02: R50.2
dds_d03: R50.1
dds_d04: R53.4
dds_d05: R53.3
dds_d06: R53.2
dds_d07: R53.1
dds_d08: R56.4
dds_d09: R56.3
dds_d10: R56.2
dds_d11: R56.1
dds_d12: R57.4
dds_d13: R57.3
dds_d14: R57.2
dds_d15: R57.1
dds_f0: R60.3
dds_f1: R60.2
dds_io_reset: D21.71(I/O_RESET)
dds_io_update: D21.59(I/O_UPDATE)
dds_master_reset: D21.14(MASTER_RESET)
dds_pdclk: D21.40(PDCLK)
dds_profile0: D21.54(PROFILE0)
dds_profile1: D21.53(PROFILE1)
dds_profile2: D21.52(PROFILE2)
dds_sclk: D21.69(SCLK)
dds_sdio: D21.67(SDIO)
dds_sdo: D21.68(SDO)
dds_sync_n: D21.8(SYNC_IN-)
dds_sync_p: D21.7(SYNC_IN+)
dds_sync_smp_err: D21.12(SYNC_SMP_ERR)
dds_txenable: D21.41(TXENABLE)
EXT_REF: C144.1 D23.2(RF1)
EXT_REF_ctrl: D23.14(CTRL)
GND: C143.1 C173.1 C176.1 C178.1 C179.1 C180.1 C181.1 C183.1 C186.1 C187.1 C189.1 C191.1 C193.1 C196.1 D21.13(DGND) D21.16(DGND) D21.18(EXT_PWR_DWN) D21.22(DGND) D21.29(DGND) D21.46(DGND) D21.51(DGND) D21.58(DGND) D21.60(OSK) D21.62(DRCTL) D21.63(DRHOLD) D21.65(DGND) R55.1 T6.2(S)
LED_Ext_Ref: T6.1(G)
MISO_LTC6951: D22.20(SDO)
MOSI_LTC6951: D22.19(SDI)
ram_swp_ovr: D21.24(RAM_SWP_OVR)
ref_freq_rx_n: C156.1
ref_freq_rx_p: C157.1
SCLK_LTC6951: D22.18(SCLK)
STAT_LTC6951: D22.38(STAT)
SYNC_LTC6951: D22.39(SYNC) R76.2
NetC143_2: C143.2 T5.4
NetC144_2: C144.2 XW2.S(RF)
NetC145_2: C145.2 C146.2 Q1.4(VDD) R59.1
NetC147_2: C147.2 R61.1 R63.1
NetC148_2: C148.2 C150.1 L30.2 R64.1
NetC149_2: C149.2 C152.1 R67.1
NetC150_2: C150.2 C154.1 R71.1
NetC151_1: C151.1 L29.2 L30.1
NetC153_2: C153.2 L31.2 L32.1
NetC154_2: C154.2 C155.2 L32.2 R70.2
NetC156_2: C156.2 D22.9(OUT0+)
NetC157_2: C157.2 D22.8(OUT0-)
NetC158_2: C158.2 D22.3(OUT2+)
NetC159_2: C159.2 D22.2(OUT2-)
NetC160_2: C160.2 D22.12(OUT3+)
NetC161_2: C161.2 D22.24(TB) D22.26(CMC) D22.27(CMB) D22.28(CMA)
NetC162_2: C162.2 D22.11(OUT3-)
NetC165_2: C165.2 R74.2
NetC174_2: C174.2 C175.2 D22.33(VCP+) R75.1
NetC184_2: C184.2 D22.30(BVCO)
NetC188_1: C188.1 D22.22(BB)
NetD21_25: D21.25(D15) R57.8
NetD21_26: D21.26(D14) R57.7
NetD21_27: D21.27(D13) R57.6
NetD21_31: D21.31(D12) R57.5
NetD21_32: D21.32(D11) R56.8
NetD21_33: D21.33(D10) R56.7
NetD21_34: D21.34(D9) R56.6
NetD21_35: D21.35(D8) R56.5
NetD21_36: D21.36(D7) R53.8
NetD21_37: D21.37(D6) R53.7
NetD21_38: D21.38(D5) R53.6
NetD21_39: D21.39(D4) R53.5
NetD21_42: D21.42(D3) R50.8
NetD21_43: D21.43(D2) R50.7
NetD21_44: D21.44(D1) R50.6
NetD21_48: D21.48(D0) R50.5
NetD21_49: D21.49(F1) R60.7
NetD21_50: D21.50(F0) R60.6
NetD21_84: D21.84(DAC_RSET) R51.2
NetD23_7: D23.7(RFC) T7.6
NetH4_1: H4.1(K) R54.1
NetL33_1: L33.1 R73.1
NetQ1_3: Q1.3(OUT) R61.2 R62.1
NetR54_2: R54.2 T6.3(D)
NetR64_2: R64.2 R69.1 R70.1
NetR65_2: R65.2 R66.2 R68.1

Not connected (* = marked no-connect by the designer): D21 1(NC)* 2(LOOP_FILTER)* 9(SYNC_OUT+)* 10(SYNC_OUT-)* 19(PLL_LOCK)* 20(NC)* 61(DROVER)* 72(NC)* 86(NC)* 87(NC)* 93(NC)* 94(REFCLK_OUT)* 97(NC)* 98(NC)* 99(NC)* 100(NC)*; D22 5(OUT1-)* 6(OUT1+)*; Q1 1(NC)*; R60 1 4 5 8; T5 2*; T7 2*

### Layout directives
differential pair: _ext_ref_n, _ext_ref_p, _iout_dds_n, _iout_dds_p, _lo1_ref_n, _lo1_ref_p, cpld_clk_n, cpld_clk_p, DDS_clk_n, DDS_clk_p, dds_sync_n, dds_sync_p, ref_freq_rx_n, ref_freq_rx_p

### Notes on the sheet
- External reference for RX side 10 MHZ
- 300MHz ANTI-ALIAS FILTER (AAF)
- (near C148) ZOUT = 100Ω
- Fref = 10MHz
  R = 1
- (near R73) 105kHz BW with 10MHz PFD frequency & 11.2mA CP current & 50 deg phase margin
- DCR = 7.0Ω
- OUT0 = 1GHz CML DDS
  OUT1 = 125MHz CML LO1
  OUT2 = 125MHz CML FPGA
  OUT3 = NC CML
  OUT4 = 62.5MHz LVDS CPLD
- LO2 RX side
- (near D23) LS CTRL RFC–RF1 RFC–RF2
  0    0      OFF      ON
  0    1       ON      OFF
  1    0       ON      OFF
  1    1      OFF      ON
- Подп. и дата
- Инв. № дубл.
- Взам. инв. №
- Инв. № подл.
- Лист
- Изм.
- № докум.
- Подп.
- Дата
- Копировал
- Формат А3
- (in symbol AD9910, part A) DDS
- (in symbol AD9910, part B) DDS
- (in symbol LTC6951, part A) G
- (in symbol LTC6951, part B) CTRL; G
- (in symbol PE42553, part A) -1 dB

### Library data of the parts
C143 C144 C147 C148 C155-C160 C162 C190 C194 = CAP: as C1 on sheet RX
C145 C175 C177 C182 C185 = CAP: as C11 on sheet RX
C146 C174 = CAP: SMD Capacitor; Manufacturer: Murata; Material: X7R; Tolerance: 10%; Voltage: 10V; Type: Ceramic Capacitor; P/N: GRM21BR71A105KA01K
C149 C152 = CAP: SMD Capacitor; Manufacturer: Murata; Material: NP0; Voltage: 50V; Type: Ceramic Capacitor; P/N: GJM1555C1H3R9WB01D
C150 C154 = CAP: SMD Capacitor; Manufacturer: Murata; Material: NP0; Voltage: 50V; Type: Ceramic Capacitor; P/N: GJM1555C1H6R8WB01D
C151 C153 = CAP: SMD Capacitor; Manufacturer: Murata; Material: NP0; Voltage: 50V; Type: Ceramic Capacitor; P/N: GJM1555C1H8R2WB01D
C161 C184 = CAP: as C71 on sheet ADC
C163 = CAP: SMD Capacitor; Manufacturer: Murata; Material: NP0; Voltage: 50V; Type: Ceramic Capacitor; P/N: GRM1885C1H132JA01D
C164 = CAP: SMD Capacitor; Manufacturer: Murata; Material: NP0; Voltage: 100V; Type: Ceramic Capacitor; P/N: GCM1885C2A821FA16D
C165 = CAP: SMD Capacitor; Manufacturer: Murata; Material: NP0; Voltage: 50V; Type: Ceramic Capacitor; P/N: GRM31C5C1H623JA01K
C166-C173 C176 C178-C181 C183 C186 C187 C189 C191-C193 C195-C199 = CAP: as C69 on sheet ADC
C188 = CAP: SMD Capacitor; Manufacturer: Murata; Material: X7R; Tolerance: 10%; Voltage: 16V; Type: Ceramic Capacitor; P/N: GCM188R71C474KA55D
D21 = AD9910: 1 GSPS, 14-Bit, 3.3 V CMOS / Direct Digital Synthesizer; P/N: AD9910BSVZ; Name: AD9910
D22 = LTC6951: Ultralow Jitter / Multioutput Clock Synthesizer / with Integrated VCO; Name: LTC6951; P/N: LTC6951IUHF#PBF
D23 = PE42553: HaRPTM technology-enhanced absorptive SPDT; Manufacturer: Peregrine Technical Solutions; P/N: PE42553A-Z; Type: SPDT RF Switch; Name: PE42553; Package: 16-lead 3 × 3 mm QFN; Supplier 1: Digi-Key; Supplier Part Number 1: 1046-1137-1-ND
H4 = LED: as H1 on sheet RX; Package: 2.0 x 1.25 mm SMD; Type: CHIP LED LAMP; Supplier 1: Digi-Key; Supplier Part Number 1: 754-1094-1-ND
L29-L32 = Inductor RF: Chip SMD Inductor; Manufacturer: Coilcraft; Current: 680mA; Frequency: 2.7GHz; Name: 0603HP-33NXGE; Series: 0603HP; Temperature Range: -25…85°C; P/N: 0603HP-33NXGE
L33 = Inductor: Chip SMD Inductor; Manufacturer: Coilcraft; Current: 200mA; Frequency: 32MHz; Name: 1008LS; P/N: 1008LS-333XJE; DCR: 7.0Ω; Series: 1008LS; Temperature Range: -25…85°C
Q1 = CCSS-945: Ultra Low Noise / SineWave Clock Oscillator; Input Current: 15mA Typical; Name: CCSS-945-10; Output: Unsymmetry; Output Current: ±24mA Max; Voltage: 5.0V; Package: 9×14 mm SMD; Temperature Range: 0°C to +70°C; P/N: CCSS-945-20-10.000; Type: SineWave Clock Oscillator
R50 R53 R56 R57 R60 = RES 4x0402: Chip Resistor Array; Manufacturer: Panasonic; Name: EXBN8V; Number of Resistors: 4; Tolerance: 5%; P/N: ERJ-2GEJ330X; Type: 0402 Array Concave Terminal; Number of Terminals: 8; Series: EXB
R51 = RES: as R38 on sheet ADC; Temperature Range: -55…155°C
R52 R55 R58 R72 = RES: SMD Resistor; Manufacturer: Panasonic Electronic Components; Name: Chip SMD Resistor; Power: 0.062 Wt; Tolerance: 5%; P/N: ERJ-2GEJ101X; Temperature Range: -55…155°C
R54 = RES: as R4 on sheet RX; Temperature Range: -55…155°C
R59 = RES: SMD Resistor; Name: Chip SMD Resistor; Power: 0.1 Wt; Tolerance: 5%; P/N: ERJ-2GEJ5R1X; Temperature Range: -55…155°C
R61 = RES: SMD Resistor; Manufacturer: Panasonic Electronic Components; Name: Chip SMD Resistor; Power: 0.062 Wt; Tolerance: 5%; P/N: ERJ-2RKF37R4X; Temperature Range: -55…155°C
R62 R63 = RES: SMD Resistor; Manufacturer: Panasonic Electronic Components; Name: Chip SMD Resistor; Power: 0.062 Wt; Tolerance: 1%; P/N: ERJ-2RKF1500X; Temperature Range: -55…155°C
R64 R70 = RES: SMD Resistor; Manufacturer: Panasonic Electronic Components; Name: Chip SMD Resistor; Power: 0.063 Wt; P/N: ERA-2AEB201X; Temperature Range: -55…155°C
R65 R68 = RES: SMD Resistor; Manufacturer: Panasonic Electronic Components; Name: Chip SMD Resistor; Power: 0.063 Wt; P/N: ERA-2AEB68R1X; Temperature Range: -55…155°C
R66 R69 = RES: SMD Resistor; Name: Chip SMD Resistor; Power: 0.1 Wt; Tolerance: 1%; P/N: ERJ-2GE0R00X; Temperature Range: -55…155°C
R67 R71 = RES: SMD Resistor; Manufacturer: Panasonic Electronic Components; Name: Chip SMD Resistor; Power: 0.063 Wt; P/N: ERJ-2RKD24R9X; Temperature Range: -55…155°C
R73 = RES: SMD Resistor; Manufacturer: Panasonic Electronic Components; Name: Chip SMD Resistor; Power: 0.2 Wt; P/N: ERJ-2RKF1870X; Temperature Range: -55…155°C
R74 = RES: SMD Resistor; Manufacturer: Panasonic Electronic Components; Name: Chip SMD Resistor; Power: 0.2 Wt; P/N: ERJ-2RKF1960X; Temperature Range: -55…155°C
R75 = RES: SMD Resistor; Name: Chip SMD Resistor; Power: 0.1 Wt; Tolerance: 1%; P/N: ERJ-3EKF15R0V; Temperature Range: -55…155°C
R76 = RES: as R33 on sheet ADC; Temperature Range: -55…155°C
T5 T7 = TC2-1TX+: RF Transformer; Manufacturer: Mini-Circuits; Name: TC2-1TX+; P/N: TC2-1TX+; Type: RF Transformer; Package: AT1521
T6 = 2N7002: as T1 on sheet RX; Name: 2N7002; Type: SOT-23; Package: SOT-23
XW2 = RF Connector: as XW1 on sheet RX; Name: SMA Jack; Type: 50 Ohms, SMA Jack, Vertical, PCB SMT, Gold (Au) Body; Supplier 1: Digi-Key; Supplier Part Number 1: WM9458-ND

## Sheet CPLD.SchDoc: {Наименование}
size 420 x 297 mm; DocumentNumber: НРДЦ.ХХХХХХ.ХХХ ХХ; SheetNumber: {}; SheetTotal: {}; PageSetup: Record=PageOptions|CenterHorizontal=False|CenterVertical=False|PrintScale=0.95|XCorrection=0.00|YCorrection=0.00|PrintKind=1|BorderSize=5000000|LeftOffset=0|BottomOffset=0|Orientation=1|PaperLength=1000|PaperWidth=1000|Scale=100|PaperSource=15|PrintQuality=600|MediaType=1|DitherType=10|PaperKind=A4|PrintScaleMode=1; Rule: PcbType=ProtelPcb
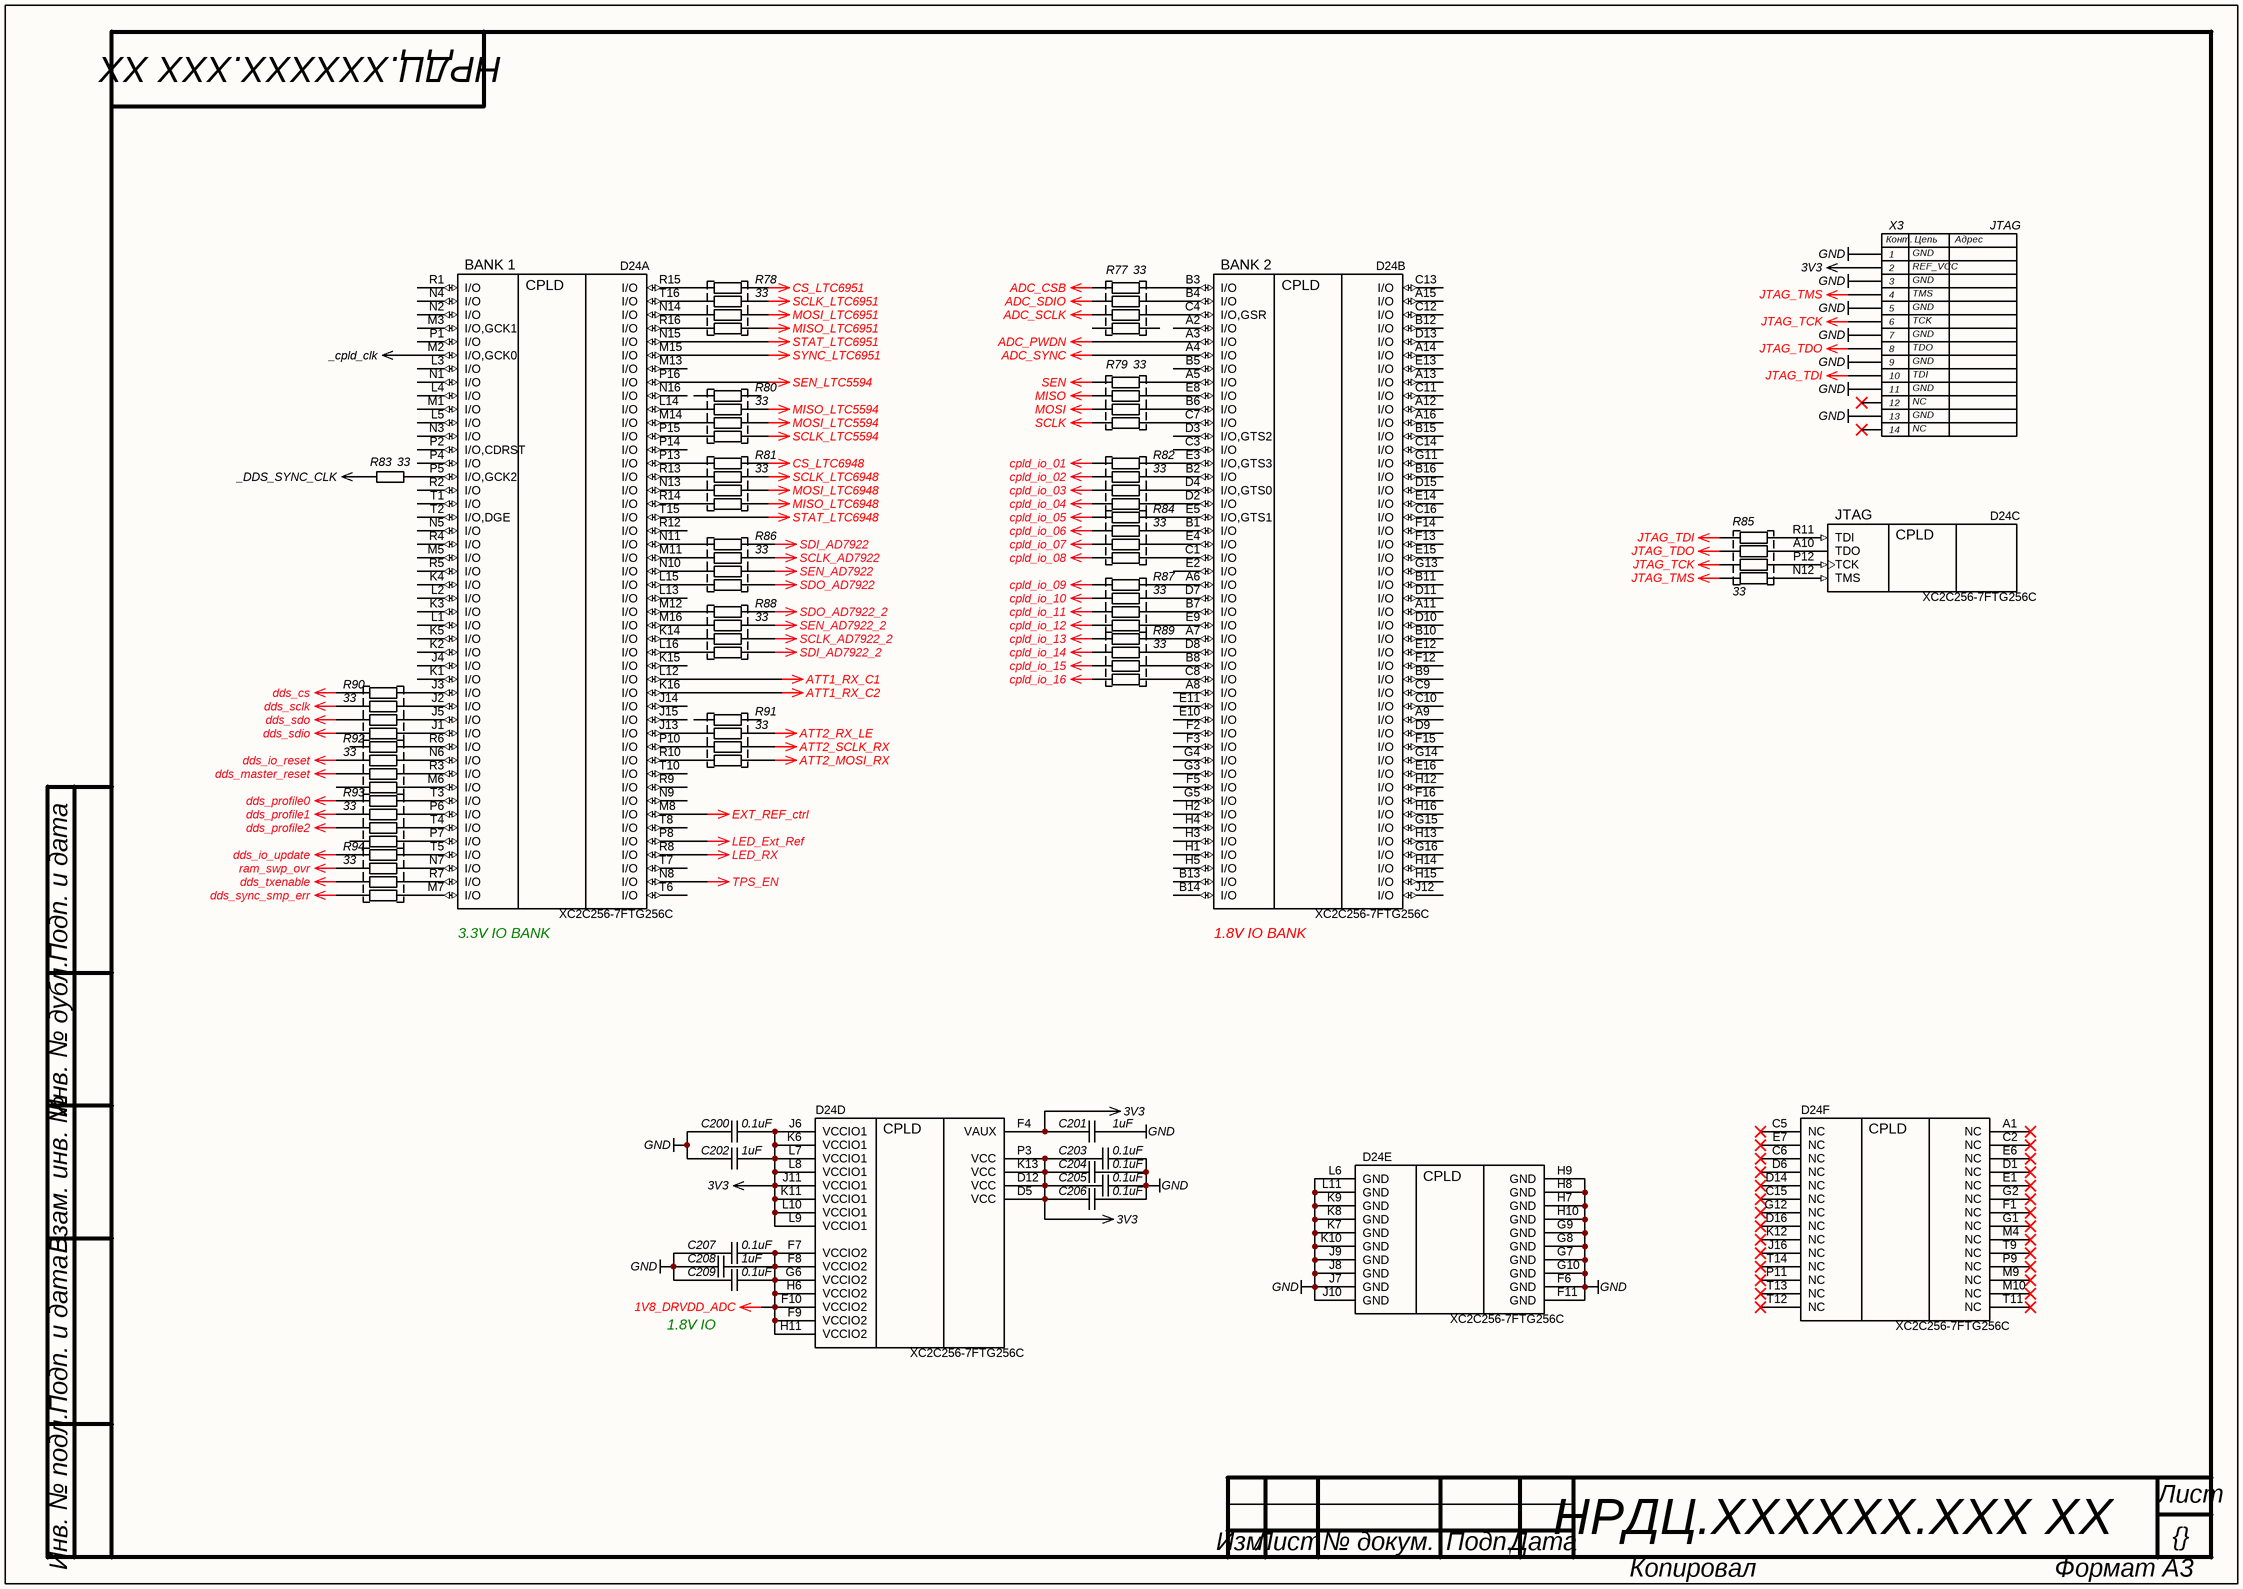
[diagram p3: CPLD.SchDoc]

### Parts
C200  value 0.1uF  [C0402]  (hidden comment: CAP)
C201  value 1uF  [C0402]  (hidden comment: CAP)
C202  value 1uF  [C0402]  (hidden comment: CAP)
C203  value 0.1uF  [C0402]  (hidden comment: CAP)
C204  value 0.1uF  [C0402]  (hidden comment: CAP)
C205  value 0.1uF  [C0402]  (hidden comment: CAP)
C206  value 0.1uF  [C0402]  (hidden comment: CAP)
C207  value 0.1uF  [C0402]  (hidden comment: CAP)
C208  value 1uF  [C0402]  (hidden comment: CAP)
C209  value 0.1uF  [C0402]  (hidden comment: CAP)
D24  XC2C256-7FTG256C  [FTG256]  (parts A,B,C,D,E,F of 6)
R77  value 33  [EXN8V]  (hidden comment: RES 4x0402)
R78  value 33  [EXN8V]  (hidden comment: RES 4x0402)
R79  value 33  [EXN8V]  (hidden comment: RES 4x0402)
R80  value 33  [EXN8V]  (hidden comment: RES 4x0402)
R81  value 33  [EXN8V]  (hidden comment: RES 4x0402)
R82  value 33  [EXN8V]  (hidden comment: RES 4x0402)
R83  value 33  [R0402]  (hidden comment: RES)
R84  value 33  [EXN8V]  (hidden comment: RES 4x0402)
R85  value 33  [EXN8V]  (hidden comment: RES 4x0402)
R86  value 33  [EXN8V]  (hidden comment: RES 4x0402)
R87  value 33  [EXN8V]  (hidden comment: RES 4x0402)
R88  value 33  [EXN8V]  (hidden comment: RES 4x0402)
R89  value 33  [EXN8V]  (hidden comment: RES 4x0402)
R90  value 33  [EXN8V]  (hidden comment: RES 4x0402)
R91  value 33  [EXN8V]  (hidden comment: RES 4x0402)
R92  value 33  [EXN8V]  (hidden comment: RES 4x0402)
R93  value 33  [EXN8V]  (hidden comment: RES 4x0402)
R94  value 33  [EXN8V]  (hidden comment: RES 4x0402)
X3  JTAG  [JTAG Mail 2mm]

### Nets
1V8_DRVDD_ADC: C207.2 C208.2 C209.2 D24.F7(VCCIO2) D24.F8(VCCIO2) D24.F9(VCCIO2) D24.F10(VCCIO2) D24.G6(VCCIO2) D24.H6(VCCIO2) D24.H11(VCCIO2)
3V3: C200.2 C201.1 C202.2 C203.1 C204.1 C205.1 C206.1 D24.D5(VCC) D24.D12(VCC) D24.F4(VAUX) D24.J6(VCCIO1) D24.J11(VCCIO1) D24.K6(VCCIO1) D24.K11(VCCIO1) D24.K13(VCC) D24.L7(VCCIO1) D24.L8(VCCIO1) D24.L9(VCCIO1) D24.L10(VCCIO1) D24.P3(VCC) X3.2
_cpld_clk: D24.M2(I/O,GCK0)
_DDS_SYNC_CLK: R83.1
ADC_CSB: R77.5
ADC_PWDN: D24.A3(I/O)
ADC_SCLK: R77.7
ADC_SDIO: R77.6
ADC_SYNC: D24.A4(I/O)
ATT1_RX_C1: D24.L12(I/O)
ATT1_RX_C2: D24.K16(I/O)
ATT2_MOSI_RX: R91.1
ATT2_RX_LE: R91.3
ATT2_SCLK_RX: R91.2
cpld_io_01: R82.5
cpld_io_02: R82.6
cpld_io_03: R82.7
cpld_io_04: R82.8
cpld_io_05: R84.5
cpld_io_06: R84.6
cpld_io_07: R84.7
cpld_io_08: R84.8
cpld_io_09: R87.5
cpld_io_10: R87.6
cpld_io_11: R87.7
cpld_io_12: R87.8
cpld_io_13: R89.5
cpld_io_14: R89.6
cpld_io_15: R89.7
cpld_io_16: R89.8
CS_LTC6948: R81.4
CS_LTC6951: R78.4
dds_cs: R90.5
dds_io_reset: R92.6
dds_io_update: R94.5
dds_master_reset: R92.7
dds_profile0: R93.5
dds_profile1: R93.6
dds_profile2: R93.7
dds_sclk: R90.6
dds_sdio: R90.8
dds_sdo: R90.7
dds_sync_smp_err: R94.8
dds_txenable: R94.7
EXT_REF_ctrl: D24.M8(I/O)
GND: C200.1 C201.2 C202.1 C203.2 C204.2 C205.2 C206.2 C207.1 C208.1 C209.1 D24.F6(GND) D24.F11(GND) D24.G7(GND) D24.G8(GND) D24.G9(GND) D24.G10(GND) D24.H7(GND) D24.H8(GND) D24.H9(GND) D24.H10(GND) D24.J7(GND) D24.J8(GND) D24.J9(GND) D24.J10(GND) D24.K7(GND) D24.K8(GND) D24.K9(GND) D24.K10(GND) D24.L6(GND) D24.L11(GND) X3.1 X3.3 X3.5 X3.7 X3.9 X3.11 X3.13
JTAG_TCK: R85.6 X3.6
JTAG_TDI: R85.8 X3.10
JTAG_TDO: R85.7 X3.8
JTAG_TMS: R85.5 X3.4
LED_Ext_Ref: D24.P8(I/O)
LED_RX: D24.R8(I/O)
MISO: R79.6
MISO_LTC5594: R80.3
MISO_LTC6948: R81.1
MISO_LTC6951: R78.1
MOSI: R79.7
MOSI_LTC5594: R80.2
MOSI_LTC6948: R81.2
MOSI_LTC6951: R78.2
ram_swp_ovr: R94.6
SCLK: R79.8
SCLK_AD7922: R86.3
SCLK_AD7922_2: R88.2
SCLK_LTC5594: R80.1
SCLK_LTC6948: R81.3
SCLK_LTC6951: R78.3
SDI_AD7922: R86.4
SDI_AD7922_2: R88.1
SDO_AD7922: R86.1
SDO_AD7922_2: R88.4
SEN: R79.5
SEN_AD7922: R86.2
SEN_AD7922_2: R88.3
SEN_LTC5594: D24.P16(I/O)
STAT_LTC6948: D24.T15(I/O)
STAT_LTC6951: D24.N15(I/O)
SYNC_LTC6951: D24.M15(I/O)
TPS_EN: D24.N8(I/O)
NetD24_A5: D24.A5(I/O) R79.4
NetD24_A6: D24.A6(I/O) R87.4
NetD24_A7: D24.A7(I/O) R89.4
NetD24_A10: D24.A10(TDO) R85.2
NetD24_B1: D24.B1(I/O) R84.3
NetD24_B2: D24.B2(I/O) R82.3
NetD24_B3: D24.B3(I/O) R77.4
NetD24_B4: D24.B4(I/O) R77.3
NetD24_B6: D24.B6(I/O) R79.2
NetD24_B7: D24.B7(I/O) R87.2
NetD24_B8: D24.B8(I/O) R89.2
NetD24_C1: D24.C1(I/O) R84.1
NetD24_C4: D24.C4(I/O,GSR) R77.2
NetD24_C7: D24.C7(I/O) R79.1
NetD24_C8: D24.C8(I/O) R89.1
NetD24_D2: D24.D2(I/O) R82.1
NetD24_D4: D24.D4(I/O,GTS0) R82.2
NetD24_D7: D24.D7(I/O) R87.3
NetD24_D8: D24.D8(I/O) R89.3
NetD24_E3: D24.E3(I/O,GTS3) R82.4
NetD24_E4: D24.E4(I/O) R84.2
NetD24_E5: D24.E5(I/O,GTS1) R84.4
NetD24_E8: D24.E8(I/O) R79.3
NetD24_E9: D24.E9(I/O) R87.1
NetD24_J1: D24.J1(I/O) R90.1
NetD24_J2: D24.J2(I/O) R90.3
NetD24_J3: D24.J3(I/O) R90.4
NetD24_J5: D24.J5(I/O) R90.2
NetD24_J13: D24.J13(I/O) R91.6
NetD24_K14: D24.K14(I/O) R88.7
NetD24_L14: D24.L14(I/O) R80.6
NetD24_L15: D24.L15(I/O) R86.8
NetD24_L16: D24.L16(I/O) R88.8
NetD24_M6: D24.M6(I/O) R92.1
NetD24_M7: D24.M7(I/O) R94.1
NetD24_M11: D24.M11(I/O) R86.6
NetD24_M12: D24.M12(I/O) R88.5
NetD24_M14: D24.M14(I/O) R80.7
NetD24_M16: D24.M16(I/O) R88.6
NetD24_N6: D24.N6(I/O) R92.3
NetD24_N7: D24.N7(I/O) R94.3
NetD24_N10: D24.N10(I/O) R86.7
NetD24_N11: D24.N11(I/O) R86.5
NetD24_N12: D24.N12(TMS) R85.4
NetD24_N13: D24.N13(I/O) R81.7
NetD24_N14: D24.N14(I/O) R78.7
NetD24_P5: D24.P5(I/O,GCK2) R83.2
NetD24_P6: D24.P6(I/O) R93.3
NetD24_P7: D24.P7(I/O) R93.1
NetD24_P10: D24.P10(I/O) R91.7
NetD24_P12: D24.P12(TCK) R85.3
NetD24_P13: D24.P13(I/O) R81.5
NetD24_P15: D24.P15(I/O) R80.8
NetD24_R3: D24.R3(I/O) R92.2
NetD24_R6: D24.R6(I/O) R92.4
NetD24_R7: D24.R7(I/O) R94.2
NetD24_R10: D24.R10(I/O) R91.8
NetD24_R11: D24.R11(TDI) R85.1
NetD24_R13: D24.R13(I/O) R81.6
NetD24_R14: D24.R14(I/O) R81.8
NetD24_R15: D24.R15(I/O) R78.5
NetD24_R16: D24.R16(I/O) R78.8
NetD24_T3: D24.T3(I/O) R93.4
NetD24_T4: D24.T4(I/O) R93.2
NetD24_T5: D24.T5(I/O) R94.4
NetD24_T16: D24.T16(I/O) R78.6

Not connected (* = marked no-connect by the designer): D24 A1(NC)* A2(I/O) A8(I/O) A9(I/O) A11(I/O) A12(I/O) A13(I/O) A14(I/O) A15(I/O) A16(I/O) B5(I/O) B9(I/O) B10(I/O) B11(I/O) B12(I/O) B13(I/O) B14(I/O) B15(I/O) B16(I/O) C2(NC)* C3(I/O) C5(NC)* C6(NC)* C9(I/O) C10(I/O) C11(I/O) C12(I/O) C13(I/O) C14(I/O) C15(NC)* C16(I/O) D1(NC)* D3(I/O,GTS2) D6(NC)* D9(I/O) D10(I/O) D11(I/O) D13(I/O) D14(NC)* D15(I/O) D16(NC)* E1(NC)* E2(I/O) E6(NC)* E7(NC)* E10(I/O) E11(I/O) E12(I/O) E13(I/O) E14(I/O) E15(I/O) E16(I/O) F1(NC)* F2(I/O) F3(I/O) F5(I/O) F12(I/O) F13(I/O) F14(I/O) F15(I/O) F16(I/O) G1(NC)* G2(NC)* G3(I/O) G4(I/O) G5(I/O) G11(I/O) G12(NC)* G13(I/O) G14(I/O) G15(I/O) G16(I/O) H1(I/O) H2(I/O) H3(I/O) H4(I/O) H5(I/O) H12(I/O) H13(I/O) H14(I/O) H15(I/O) H16(I/O) J4(I/O) J12(I/O) J14(I/O) J15(I/O) J16(NC)* K1(I/O) K2(I/O) K3(I/O) K4(I/O) K5(I/O) K12(NC)* K15(I/O) L1(I/O) L2(I/O) L3(I/O) L4(I/O) L5(I/O) L13(I/O) M1(I/O) M3(I/O,GCK1) M4(NC)* M5(I/O) M9(NC)* M10(NC)* M13(I/O) N1(I/O) N2(I/O) N3(I/O) N4(I/O) N5(I/O) N9(I/O) N16(I/O) P1(I/O) P2(I/O,CDRST) P4(I/O) P9(NC)* P11(NC)* P14(I/O) R1(I/O) R2(I/O) R4(I/O) R5(I/O) R9(I/O) R12(I/O) T1(I/O) T2(I/O,DGE) T6(I/O) T7(I/O) T8(I/O) T9(NC)* T10(I/O) T11(NC)* T12(NC)* T13(NC)* T14(NC)*; R77 1 8; R80 4 5; R91 4 5; R92 5 8; R93 8; X3 12* 14*

### Notes on the sheet
- (near X3) GND
- (near X3) REF_VCC
- (near X3) TMS
- (near X3) TCK
- (near X3) TDO
- (near X3) TDI
- (near X3) NC
- (near D24) 3.3V IO BANK
- (near D24) 1.8V IO BANK
- 1.8V IO
- Подп. и дата
- Инв. № дубл.
- Взам. инв. №
- Инв. № подл.
- Лист
- Изм.
- № докум.
- Подп.
- Дата
- Копировал
- Формат А3
- (in symbol HDR Debug_14-pin) Конт.; Цепь; Адрес
- (in symbol XC2C256-7FTG256C, part A) BANK 1
- (in symbol XC2C256-7FTG256C, part B) BANK 2
- (in symbol XC2C256-7FTG256C, part C) JTAG

### Library data of the parts
C200 C203-C207 C209 = CAP: as C69 on sheet ADC
C201 C202 C208 = CAP: as C71 on sheet ADC
D24 = XC2C256-7FTG256C: CoolRunner-II 1.8V, 256 Macrocell CPLD, 184 User I/Os, 256-Ball FTBGA, Commercial Grade, Pb-Free; Code_JEDEC: MS-034-AAF-1*; PackageVersion: ver1.3, Oct-2007; PackageReference: FTG256; PackageDescription: 256-Ball Fine Pitch Thin Ball Grid Array 1.00 mm Pitch (FTG256) - Pb-Free; DatasheetVersion: ver3.2, Mar-2007; PartNumber: XC2C256-7FTG256C; P/N: XC2C256-7FTG256C; Name: XC2C256-7FTG256C; Type: CPLD
R77-R82 R84-R94 = RES 4x0402: as R50 on sheet ADC_CLK; Type: 0402 Array Concave Terminal; Number of Terminals: 8; Series: EXB
R83 = RES: SMD Resistor; Name: Chip SMD Resistor; Power: 0.062 Wt; Tolerance: 5%; P/N: ERJ-2GEJ330X; Temperature Range: -55…155°C
X3 = HDR Debug_14-pin: 2.00mm Pitch, Milli-Grid PCB Header, Dual Row, Vertical, Through Hole, Shrouded, 14 / Circuits; Manufacturer: Molex; Name: Milli-Grid Connector System; P/N: 878311421; Type: 2.00mm Pitch, Milli-Grid PCB Header, Dual Row, Vertical, Through Hole, Shrouded, 14; Series: 87831